# EAGLE schematic 05_ESP32-P4_Display_5.0_inch_V1.0 (EAGLE 9.6.2)
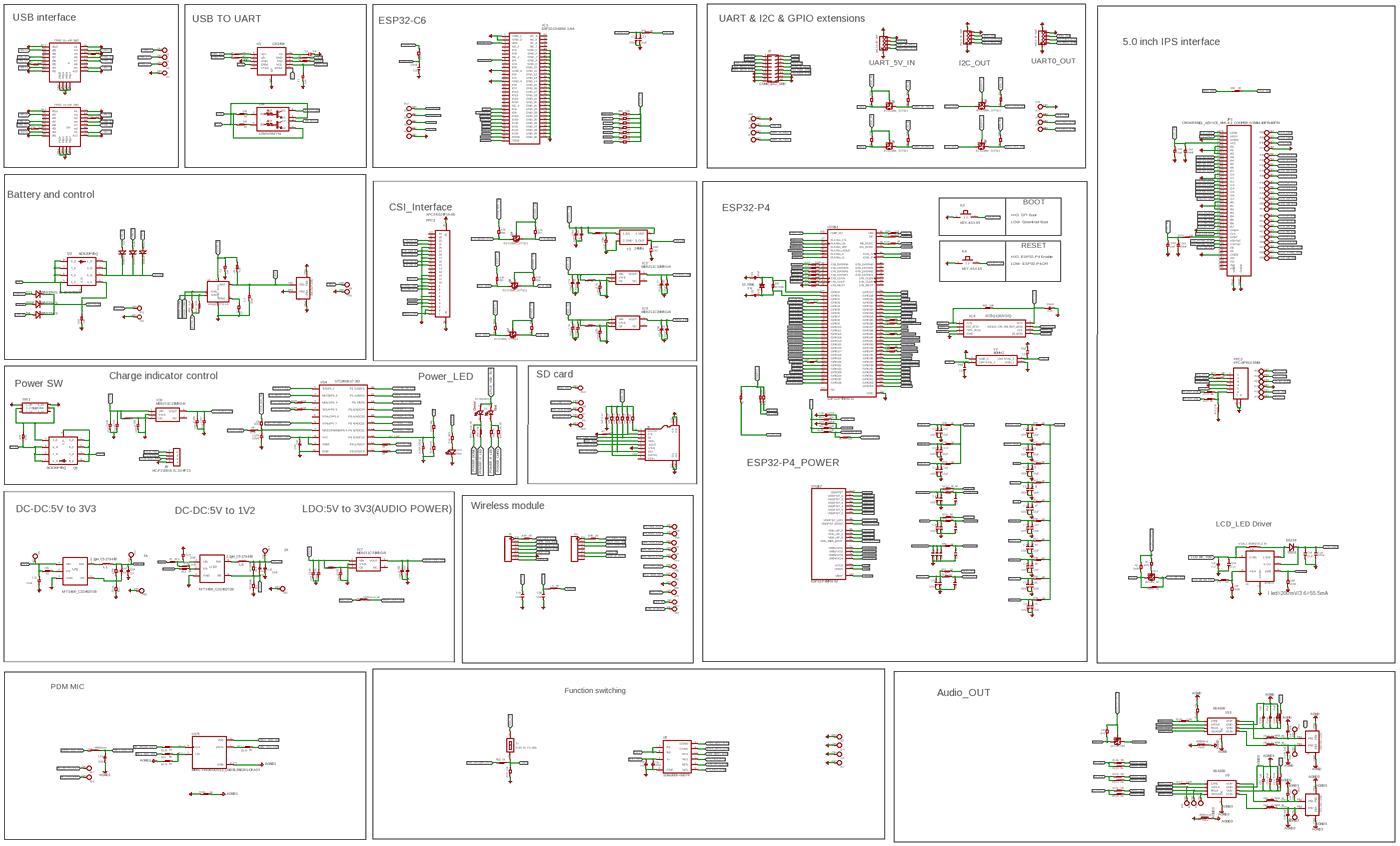
[diagram p0: schematic, sheet 1, overview]
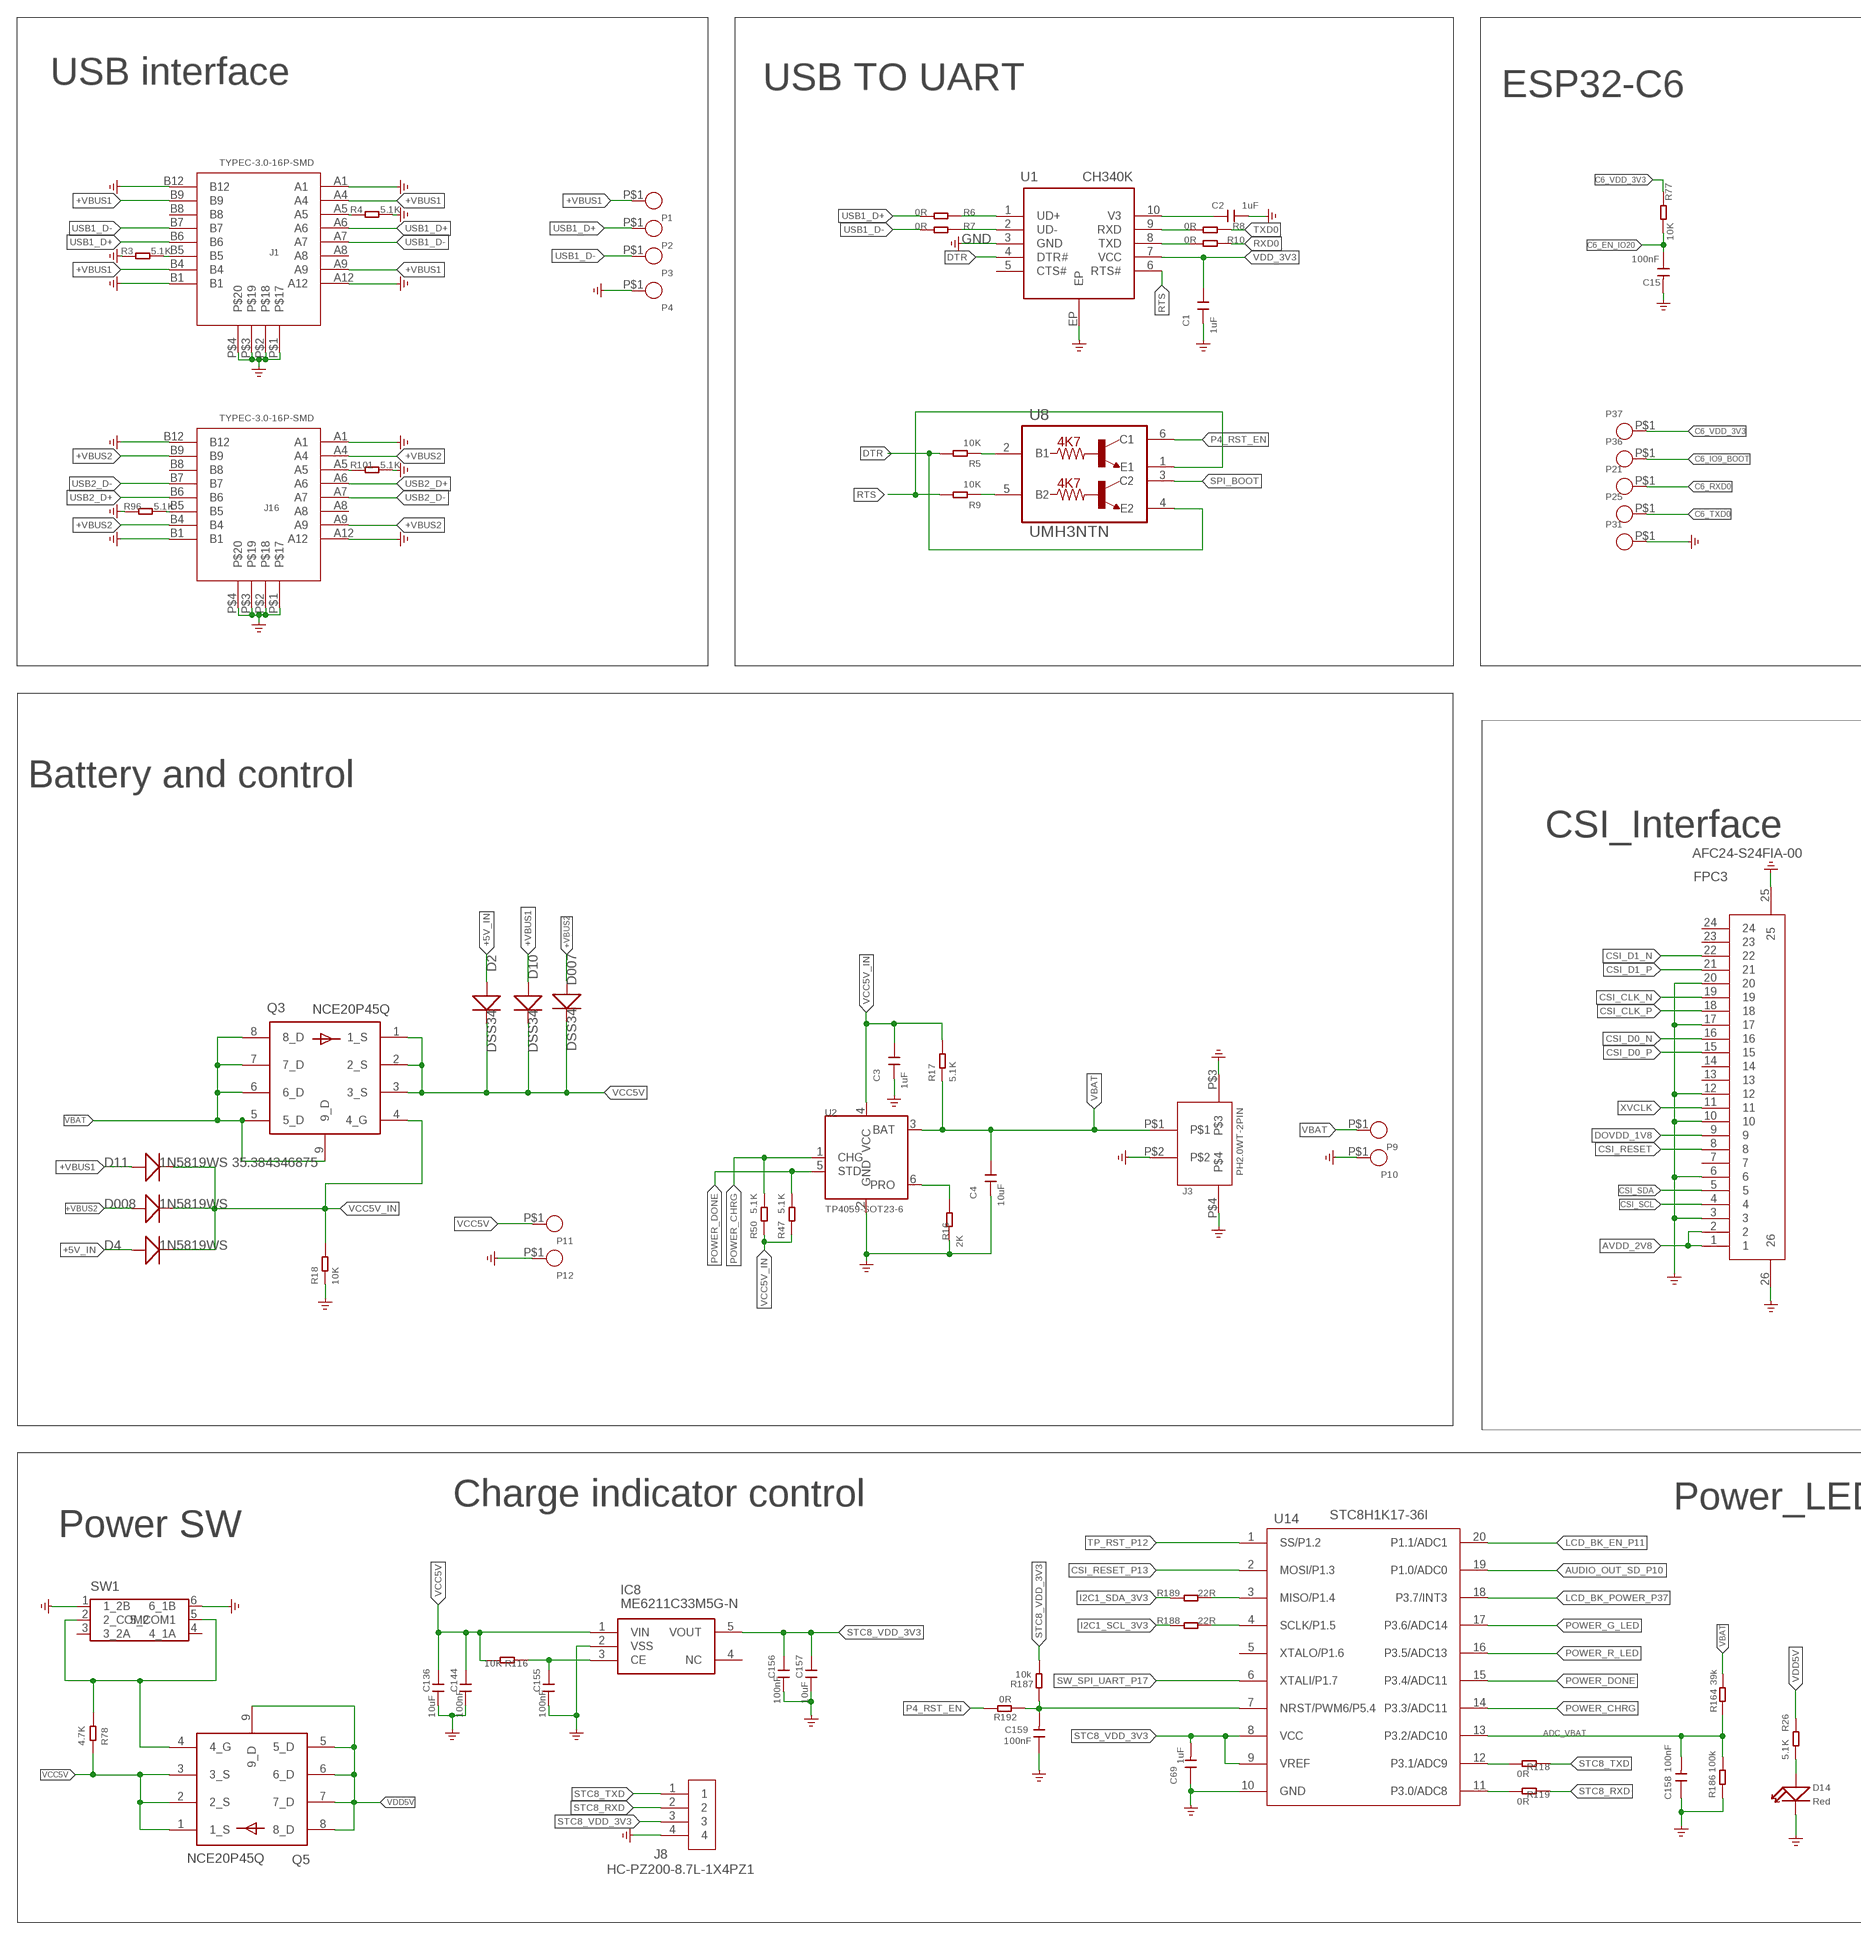
[diagram p1: schematic, sheet 1, part 1 of 8]
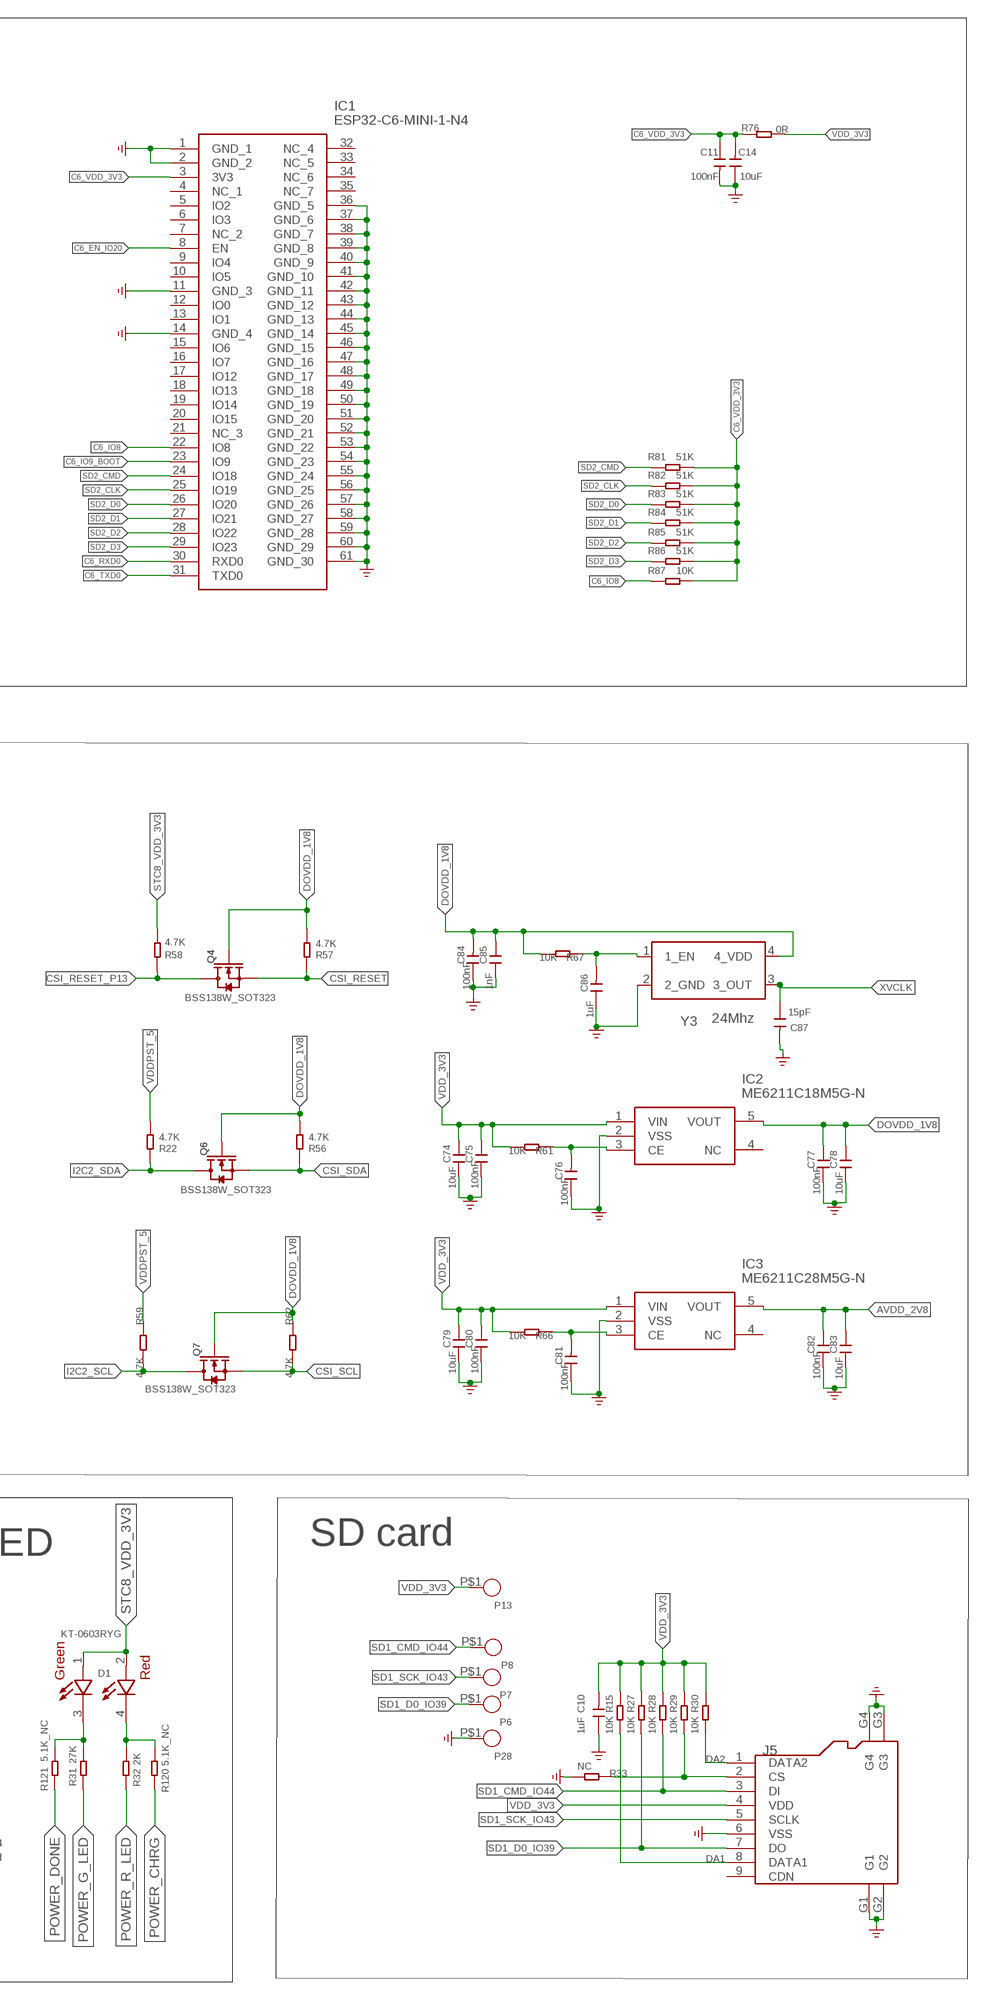
[diagram p2: schematic, sheet 1, part 2 of 8]
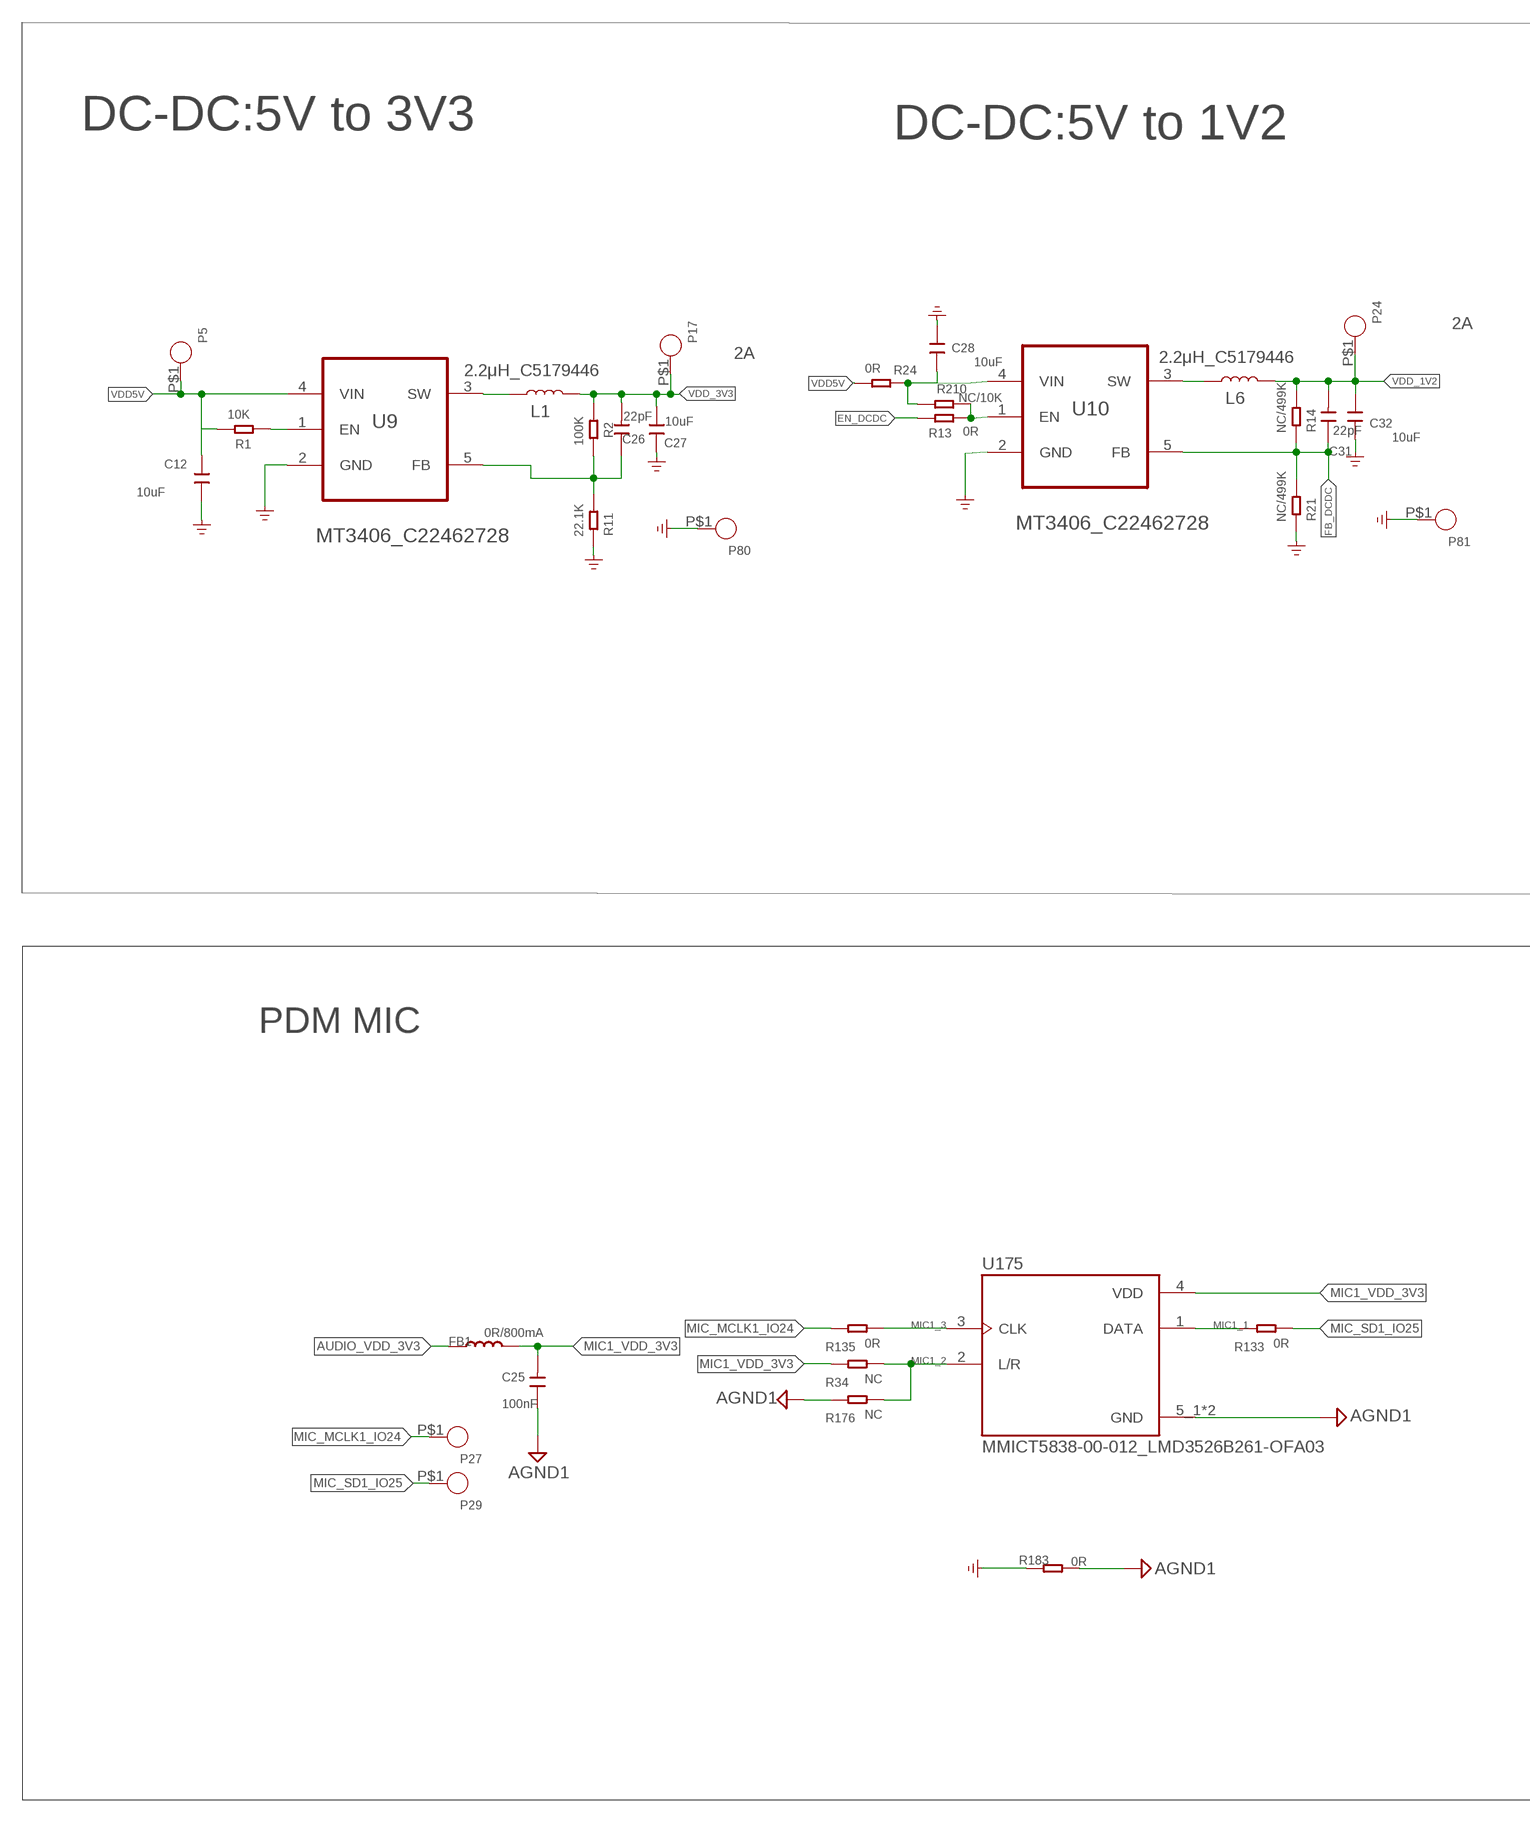
[diagram p3: schematic, sheet 1, part 3 of 8]
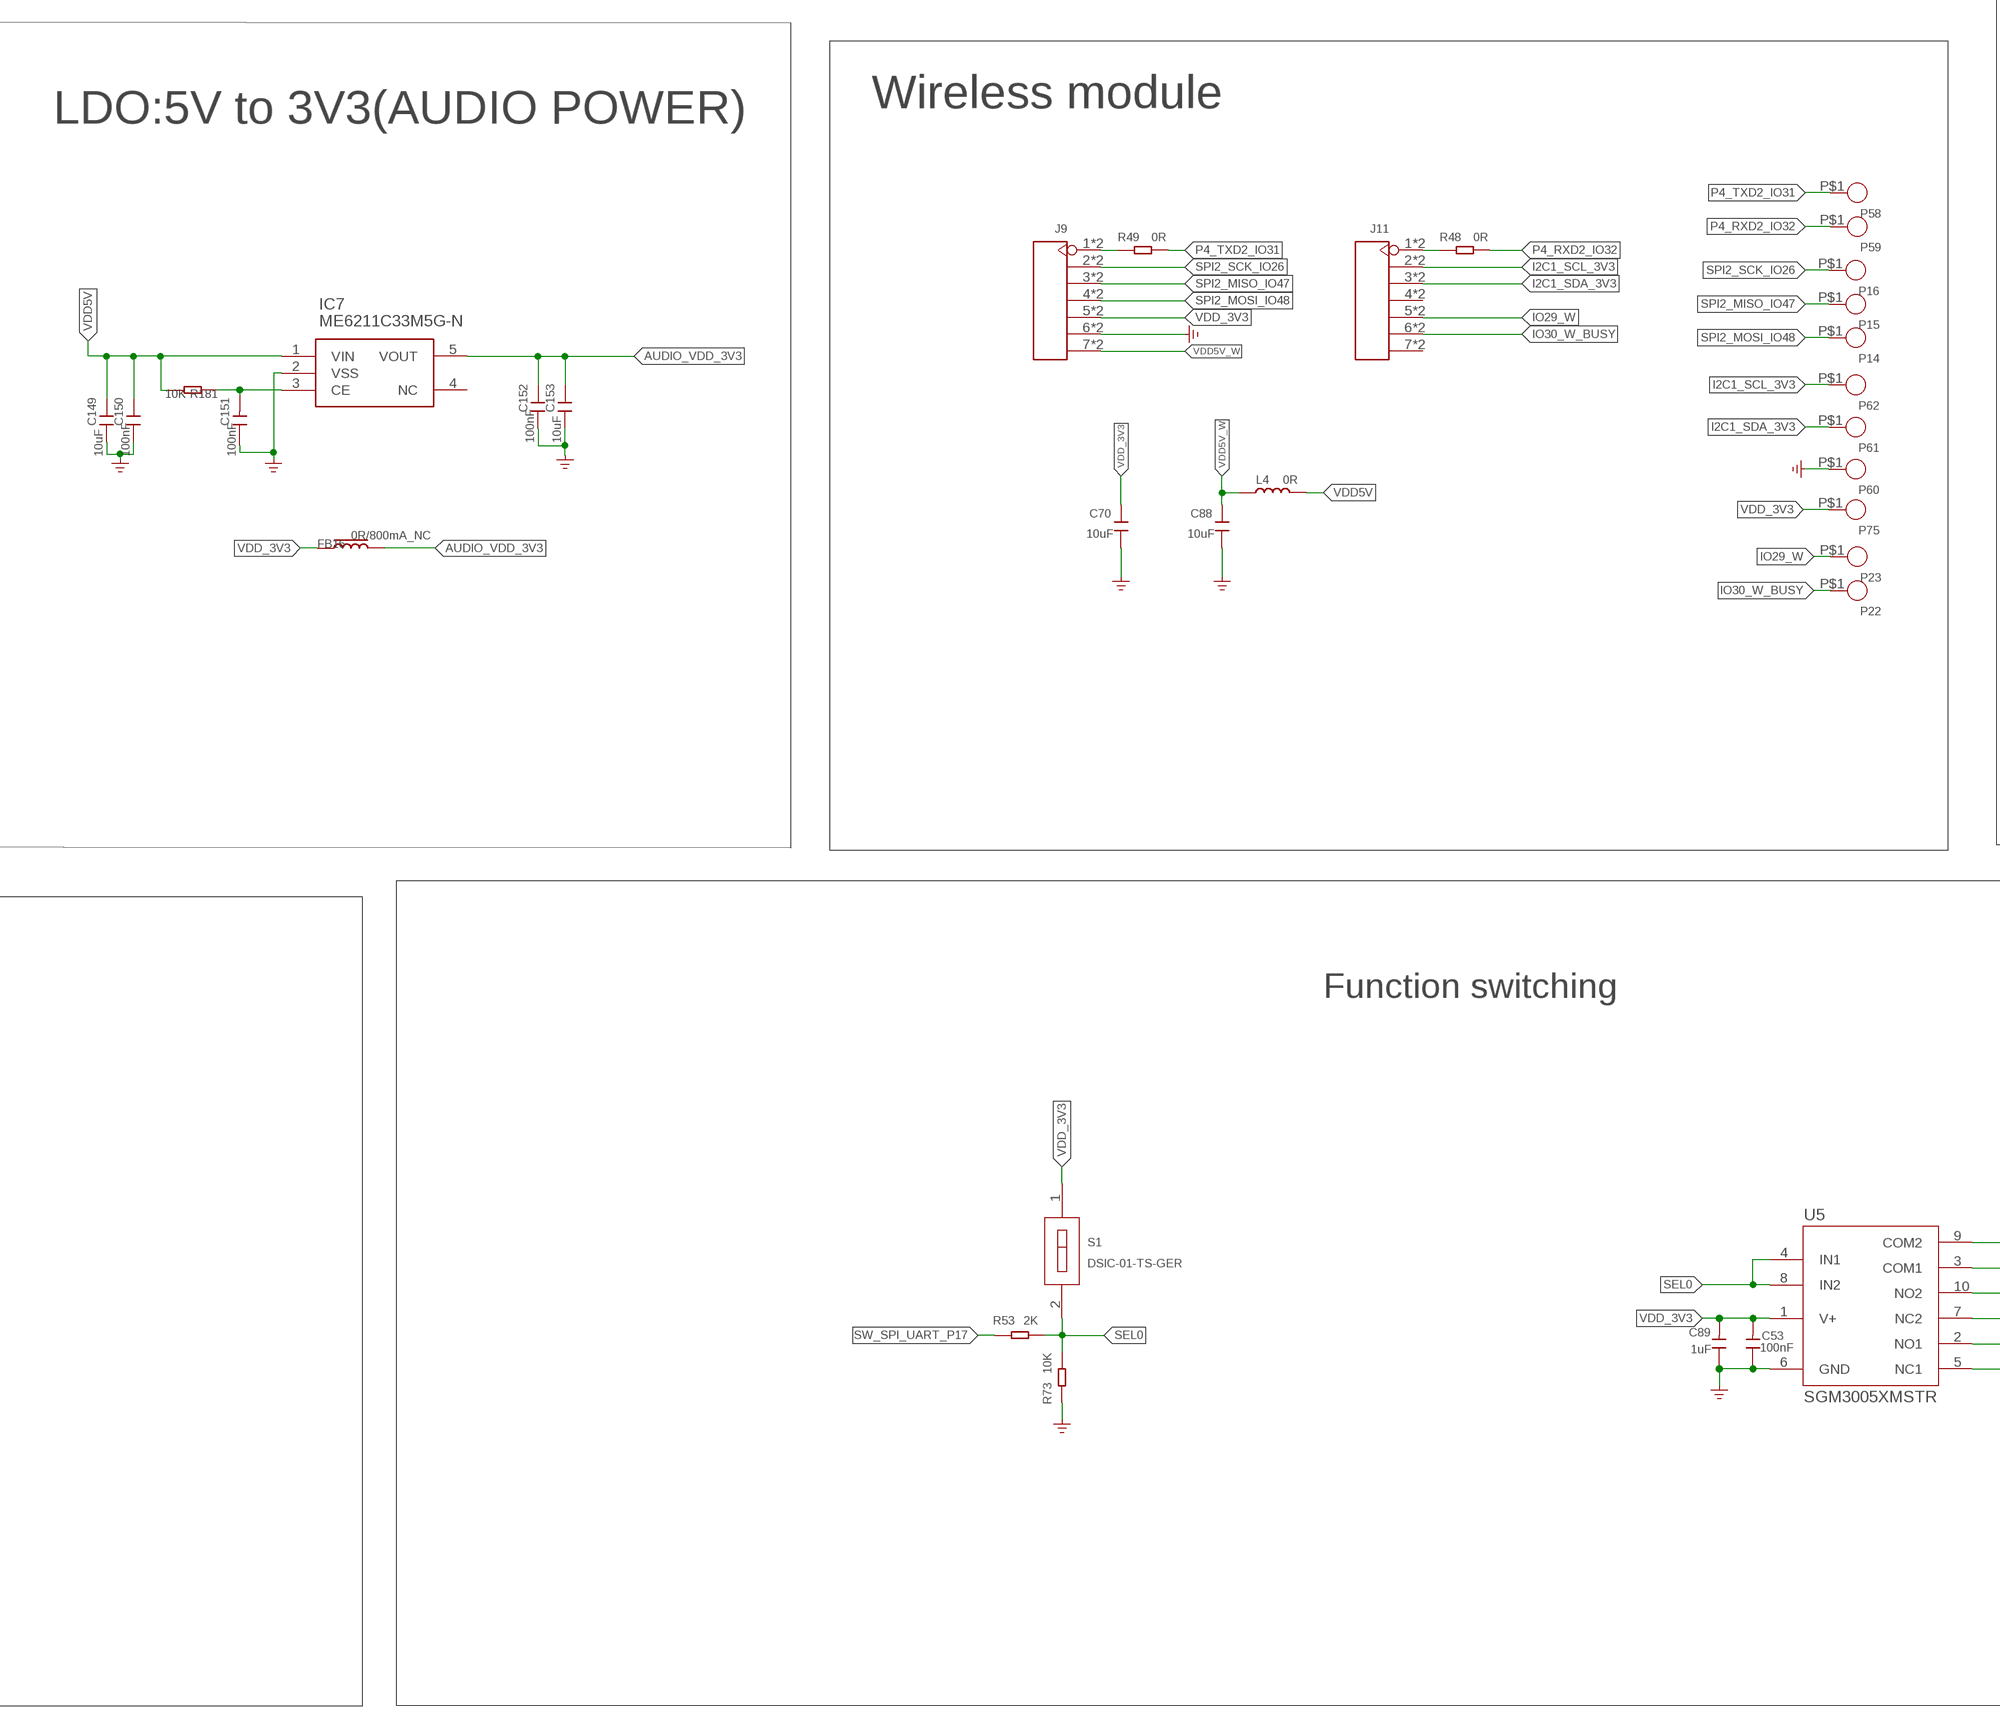
[diagram p4: schematic, sheet 1, part 4 of 8]
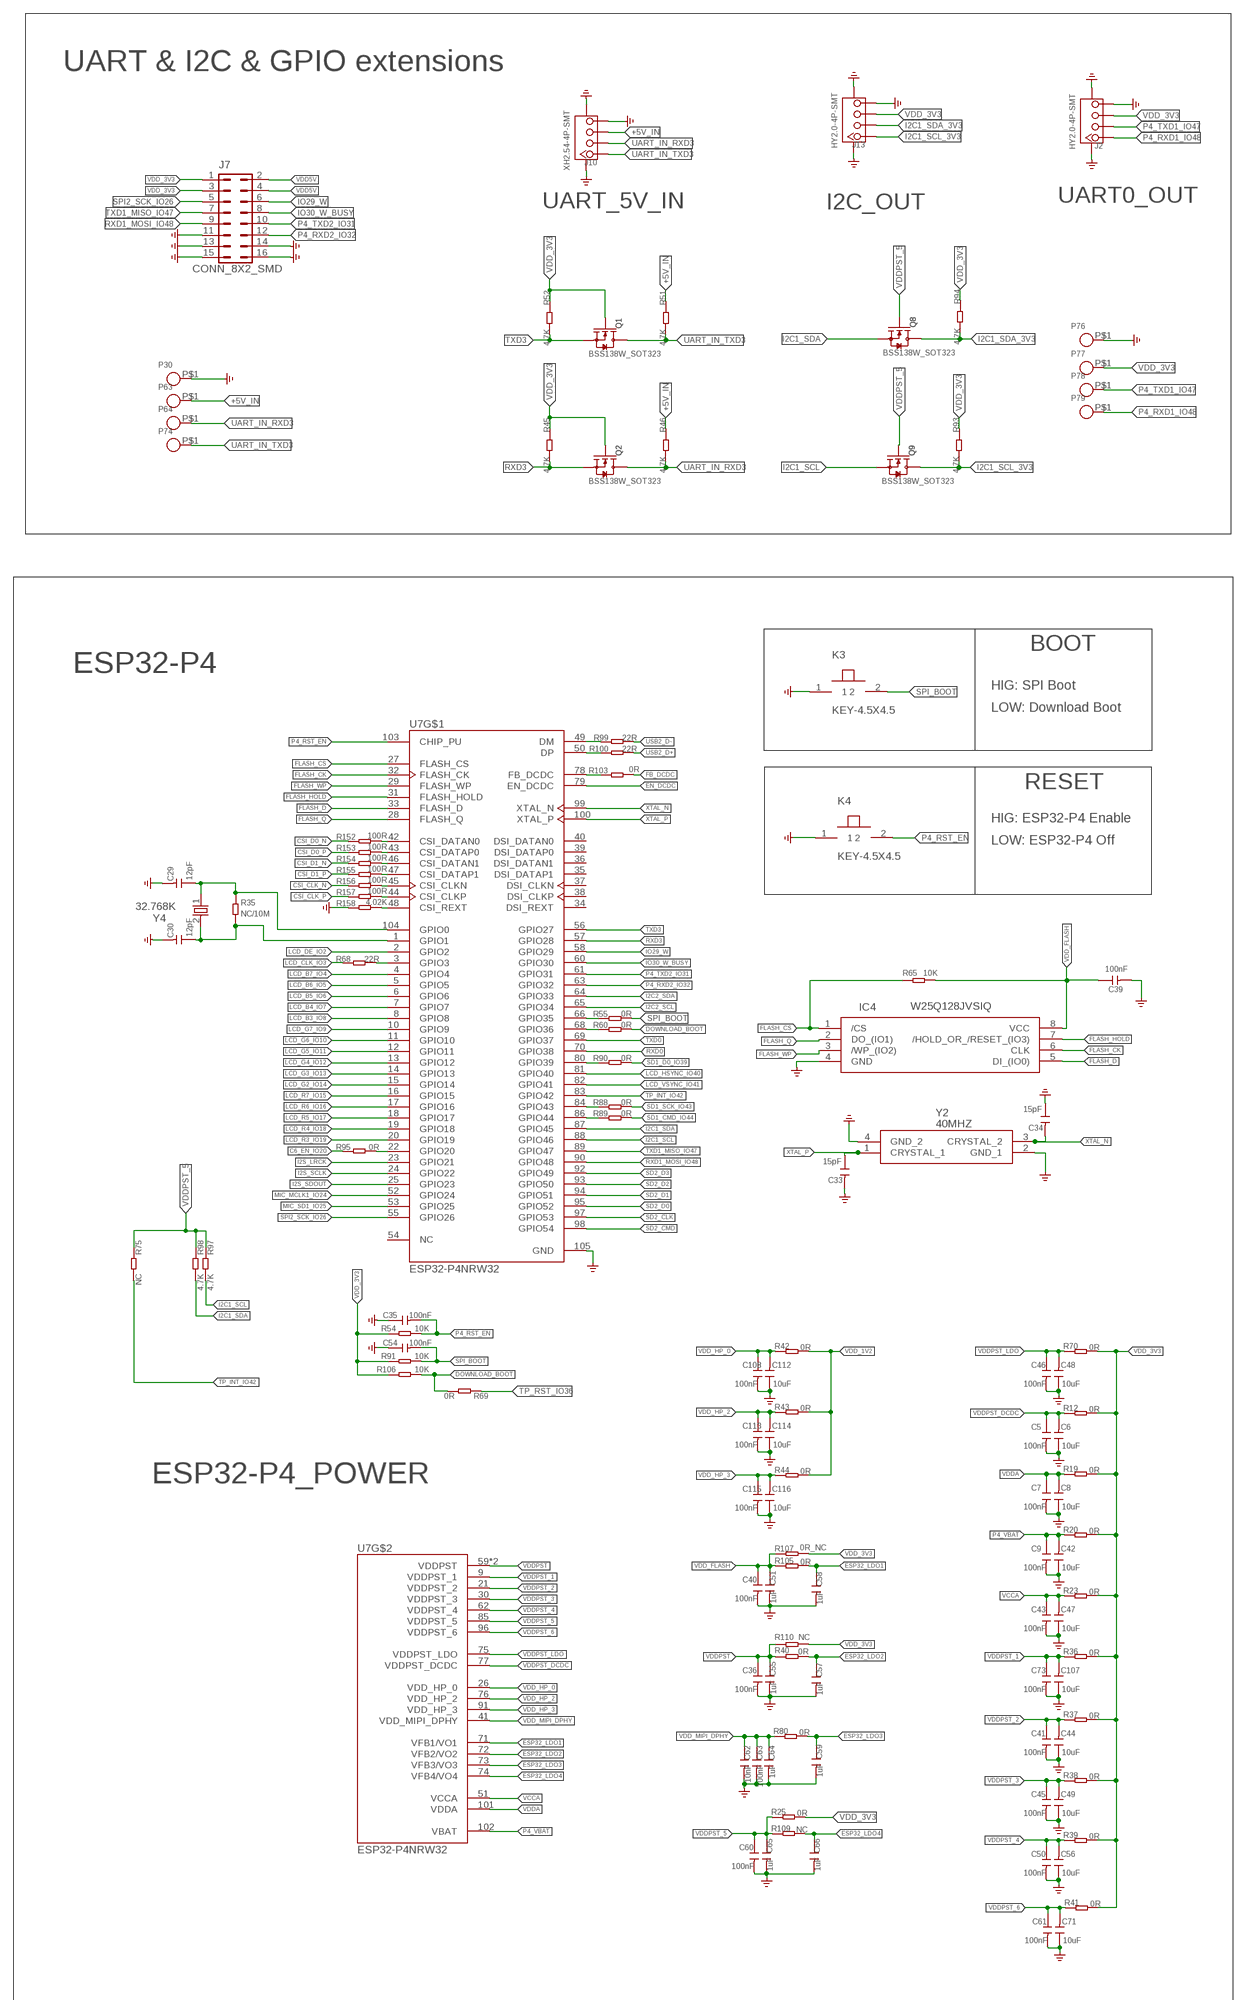
[diagram p5: schematic, sheet 1, part 5 of 8]
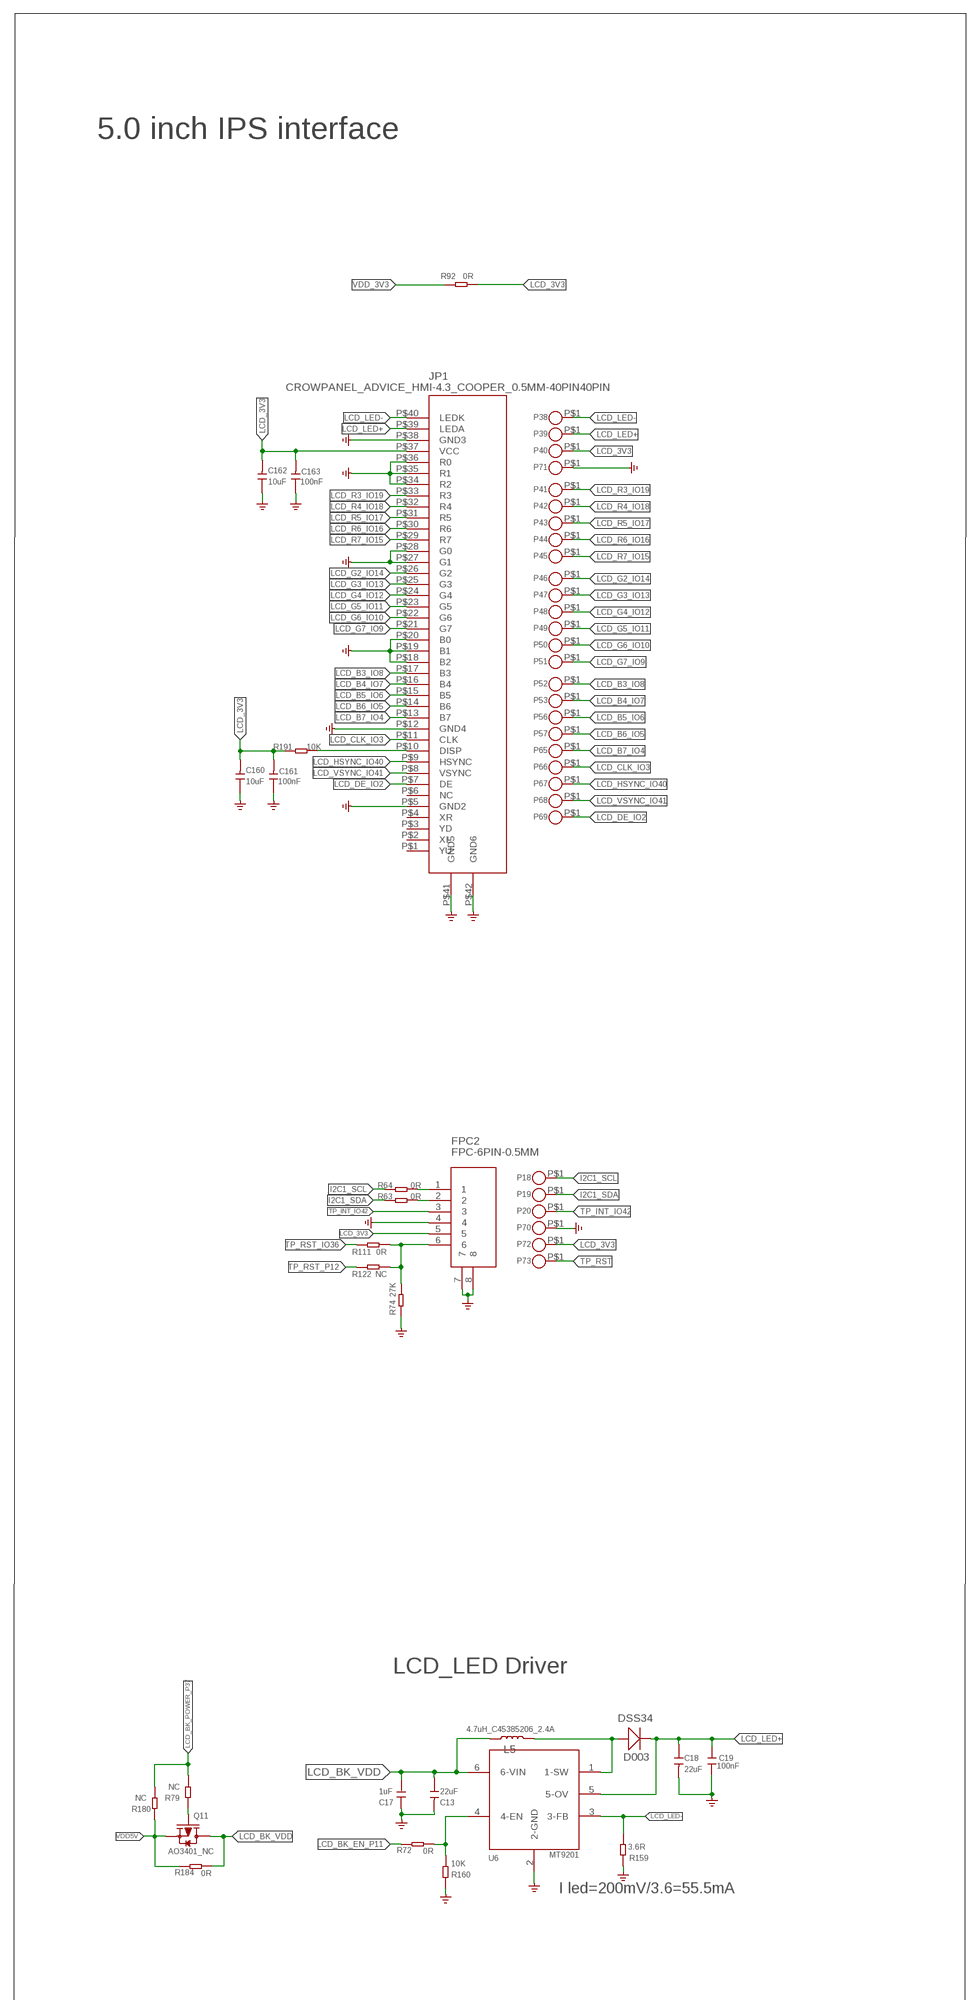
[diagram p6: schematic, sheet 1, part 6 of 8]
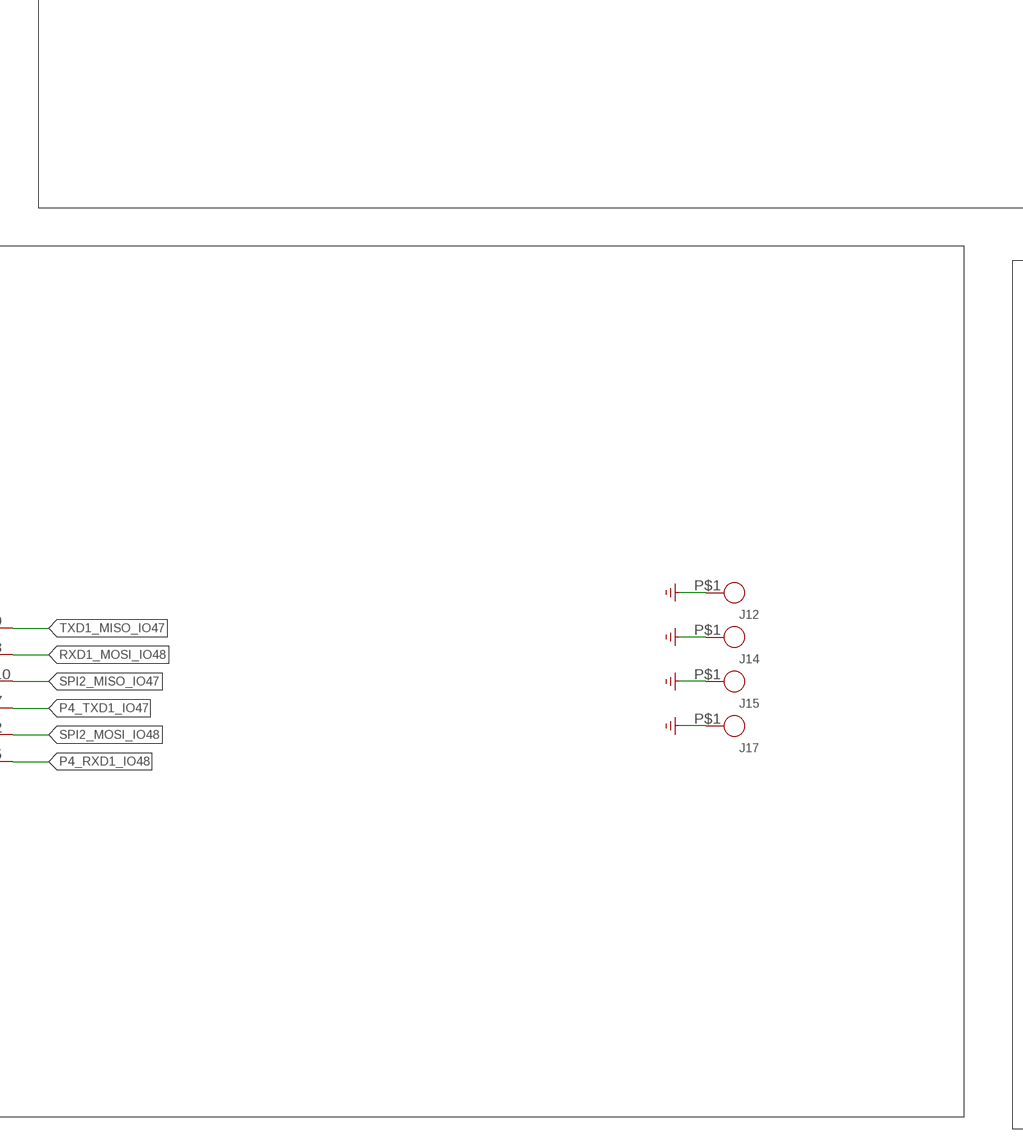
[diagram p7: schematic, sheet 1, part 7 of 8]
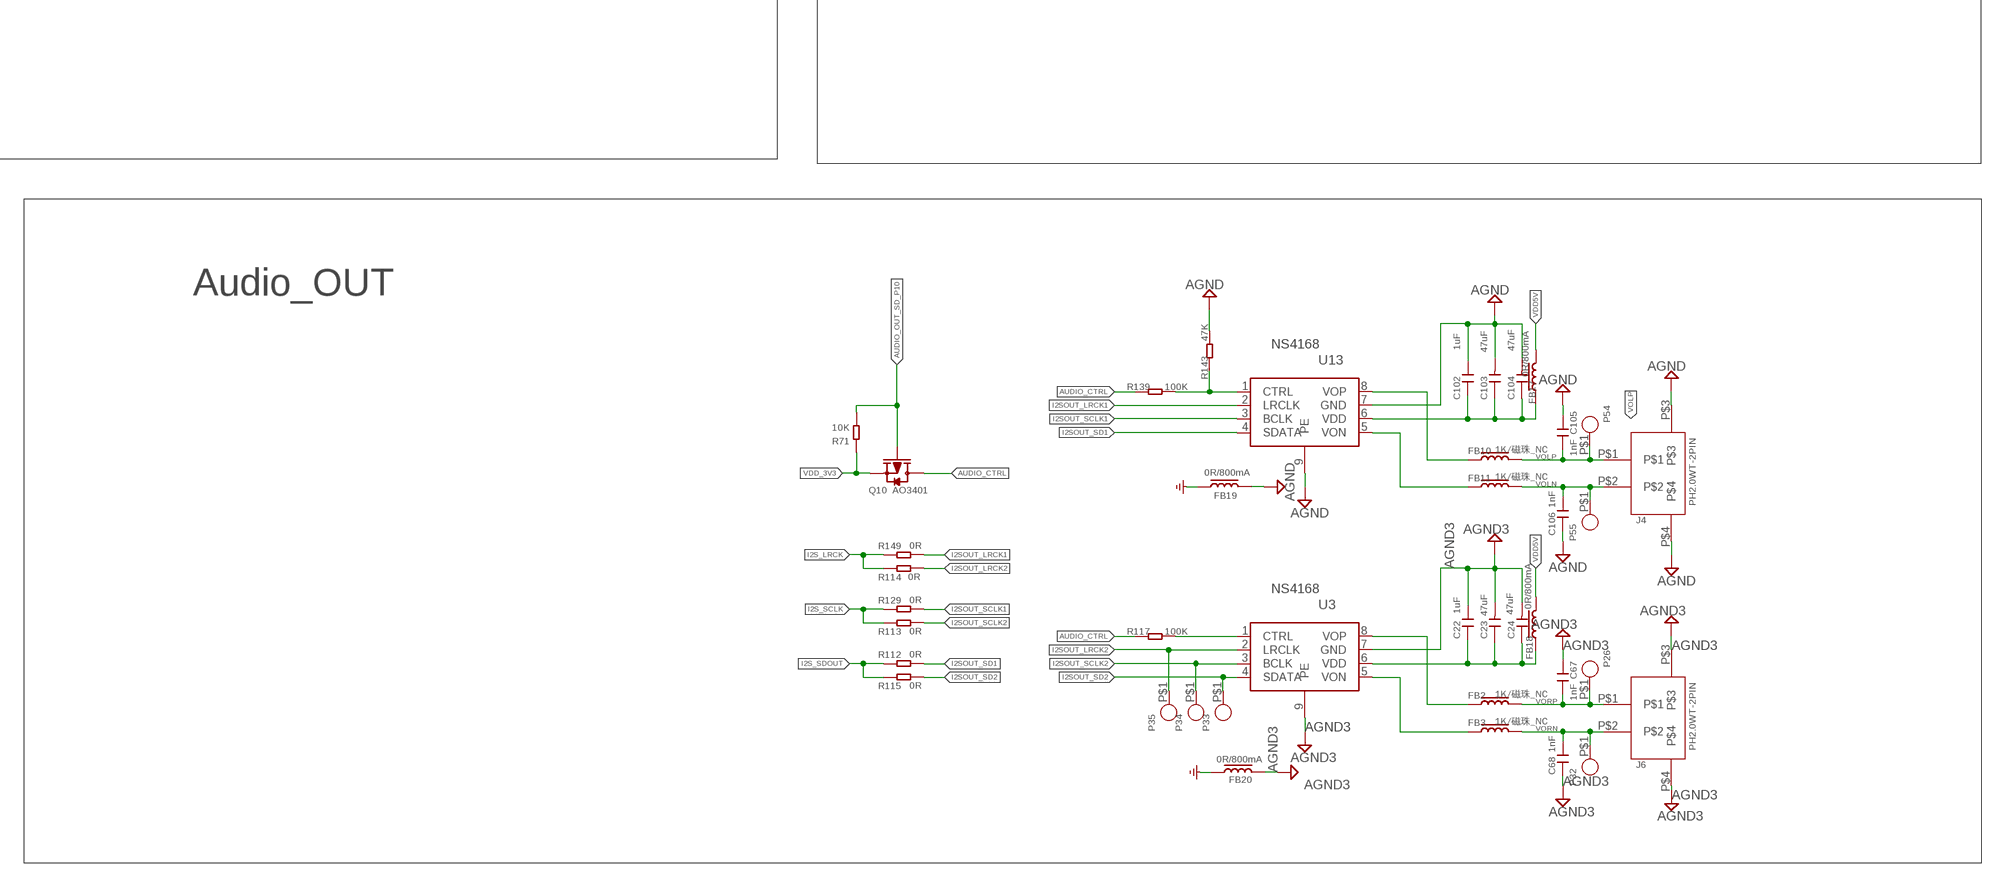
[diagram p8: schematic, sheet 1, part 8 of 8]

## Parts
C1  1uF  C0603  [0603]
C2  1uF  C0603  [0603]
C3  1uF  C0603  [0603]
C4  10uF  C0603  [0603]
C5  100nF  CAPC0402-1  [C0402]
C6  10uF  CAPC0402-1  [C0402]
C7  100nF  CAPC0402-1  [C0402]
C8  10uF  CAPC0402-1  [C0402]
C9  100nF  CAPC0402-1  [C0402]
C10  1uF  CROWPANEL_ADVANCE_HMI_CAPC0402-1  [CROWPANEL_ADVANCE_HMI_C0402]
C11  100nF  CROWPANEL_ADVANCE_HMI_CAPC0402-1  [CROWPANEL_ADVANCE_HMI_C0402]
C12  10uF  C0603  [0603]
C13  22uF  C0805  [C0805]
C14  10uF  CROWPANEL_ADVANCE_HMI_CAPC0402-1  [CROWPANEL_ADVANCE_HMI_C0402]
C15  100nF  CROWPANEL_ADVANCE_HMI_CAPC0402-1  [CROWPANEL_ADVANCE_HMI_C0402]
C17  1uF  C0603  [0603]
C18  22uF  C0805  [C0805]
C19  100nF  C0603  [0603]
C22  1uF  C0603  [0603]
C23  47uF  RC_C0805  [RC_C0805]
C24  47uF  RC_C0805  [RC_C0805]
C25  100nF  CAPC0402-1  [C0402]
C26  22pF  CROWPANEL_ADVANCE_HMI_CAPC0402-1  [CROWPANEL_ADVANCE_HMI_C0402]
C27  10uF  COOPER_C0603  [COOPER_0603]
C28  10uF  C0603  [0603]
C29  12pF  CAPC0402-1  [C0402]
C30  12pF  CAPC0402-1  [C0402]
C31  22pF  CROWPANEL_ADVANCE_HMI_CAPC0402-1  [CROWPANEL_ADVANCE_HMI_C0402]
C32  10uF  COOPER_C0603  [COOPER_0603]
C33  15pF  CAPC0402-1  [C0402]
C34  15pF  CAPC0402-1  [C0402]
C35  100nF  CROWPANEL_ADVANCE_HMI_CAPC0402-1  [CROWPANEL_ADVANCE_HMI_C0402]
C36  100nF  CAPC0402-1  [C0402]
C39  100nF  CAPC0402-1  [C0402]
C40  100nF  CAPC0402-1  [C0402]
C41  100nF  CAPC0402-1  [C0402]
C42  10uF  CAPC0402-1  [C0402]
C43  100nF  CAPC0402-1  [C0402]
C44  10uF  CAPC0402-1  [C0402]
C45  100nF  CAPC0402-1  [C0402]
C46  100nF  CAPC0402-1  [C0402]
C47  10uF  CAPC0402-1  [C0402]
C48  10uF  CAPC0402-1  [C0402]
C49  10uF  CAPC0402-1  [C0402]
C50  100nF  CAPC0402-1  [C0402]
C51  1uF  CAPC0402-1  [C0402]
C53  100nF  CAPC0402-1  [C0402]
C54  100nF  CROWPANEL_ADVANCE_HMI_CAPC0402-1  [CROWPANEL_ADVANCE_HMI_C0402]
C55  1uF  CAPC0402-1  [C0402]
C56  10uF  CAPC0402-1  [C0402]
C57  1uF  CAPC0402-1  [C0402]
C58  1uF  CAPC0402-1  [C0402]
C59  1uF  CAPC0402-1  [C0402]
C60  100nF  CAPC0402-1  [C0402]
C61  100nF  CAPC0402-1  [C0402]
C62  10nF  CAPC0402-1  [C0402]
C63  100nF  CAPC0402-1  [C0402]
C64  1uF  CAPC0402-1  [C0402]
C65  1uF  CAPC0402-1  [C0402]
C66  1uF  CAPC0402-1  [C0402]
C67  1nF  C0603  [0603]
C68  1nF  C0603  [0603]
C69  1uF  CROWPANEL_ADVANCE_HMI_CAPC0402-1  [CROWPANEL_ADVANCE_HMI_C0402]
C70  10uF  C0603  [0603]
C71  10uF  CAPC0402-1  [C0402]
C73  100nF  CAPC0402-1  [C0402]
C74  10uF  C0603  [0603]
C75  100nF  C0603  [0603]
C76  100nF  CROWPANEL_ADVANCE_HMI_CAPC0402-1  [CROWPANEL_ADVANCE_HMI_C0402]
C77  100nF  C0603  [0603]
C78  10uF  C0603  [0603]
C79  10uF  C0603  [0603]
C80  100nF  C0603  [0603]
C81  100nF  CROWPANEL_ADVANCE_HMI_CAPC0402-1  [CROWPANEL_ADVANCE_HMI_C0402]
C82  100nF  C0603  [0603]
C83  10uF  C0603  [0603]
C84  100nF  CROWPANEL_ADVANCE_HMI_CAPC0402-1  [CROWPANEL_ADVANCE_HMI_C0402]
C85  1nF  COOPER_C0603  [COOPER_0603]
C86  1uF  CROWPANEL_ADVANCE_HMI_CAPC0402-1  [CROWPANEL_ADVANCE_HMI_C0402]
C87  15pF  CAPC0402-1  [C0402]
C88  10uF  C0603  [0603]
C89  1uF  CAPC0402-1  [C0402]
C102  1uF  C0603  [0603]
C103  47uF  RC_C0805  [RC_C0805]
C104  47uF  RC_C0805  [RC_C0805]
C105  1nF  C0603  [0603]
C106  1nF  C0603  [0603]
C107  10uF  CAPC0402-1  [C0402]
C108  100nF  CAPC0402-1  [C0402]
C112  10uF  CAPC0402-1  [C0402]
C113  100nF  CAPC0402-1  [C0402]
C114  10uF  CAPC0402-1  [C0402]
C115  100nF  CAPC0402-1  [C0402]
C116  10uF  CAPC0402-1  [C0402]
C136  10uF  C0603  [0603]
C144  100nF  C0603  [0603]
C149  10uF  COOPER_C0603  [COOPER_0603]
C150  100nF  COOPER_C0603  [COOPER_0603]
C151  100nF  CROWPANEL_ADVANCE_HMI_CAPC0402-1  [CROWPANEL_ADVANCE_HMI_C0402]
C152  100nF  COOPER_C0603  [COOPER_0603]
C153  10uF  COOPER_C0603  [COOPER_0603]
C155  100nF  C0603  [0603]
C156  100nF  C0603  [0603]
C157  10uF  C0603  [0603]
C158  100nF  CROWPANEL_ADVANCE_HMI_CAPC0402-1  [CROWPANEL_ADVANCE_HMI_C0402]
C159  100nF  CROWPANEL_ADVANCE_HMI_CAPC0402-1  [CROWPANEL_ADVANCE_HMI_C0402]
C160  10uF  CROWPANEL_ADVANCE_HMI_CAPC0402-1  [CROWPANEL_ADVANCE_HMI_C0402]
C161  100nF  CROWPANEL_ADVANCE_HMI_CAPC0402-1  [CROWPANEL_ADVANCE_HMI_C0402]
C162  10uF  CROWPANEL_ADVANCE_HMI_CAPC0402-1  [CROWPANEL_ADVANCE_HMI_C0402]
C163  100nF  CROWPANEL_ADVANCE_HMI_CAPC0402-1  [CROWPANEL_ADVANCE_HMI_C0402]
D1  KT-0603RYG  [LED_KT-0603RYG]
D2  DSS34  DIODE  [D_SOD123FL]
D003  DSS34  DIODE  [D_SOD123FL]
D4  1N5819WS  DIODE0805  [D_SOD323]
D007  DSS34  DIODE  [D_SOD123FL]
D008  1N5819WS  DIODE0805  [D_SOD323]
D10  DSS34  DIODE  [D_SOD123FL]
D11  1N5819WS 35.384346875  DIODE0805  [D_SOD323]
D14  Red  LED-SMT0603  [LED0603]
FB1  0R/800mA  L0402  [L0402]
FB2  1K/磁珠_NC  FBL0603  [L0603]
FB3  1K/磁珠_NC  FBL0603  [L0603]
FB10  1K/磁珠_NC  FBL0603  [L0603]
FB11  1K/磁珠_NC  FBL0603  [L0603]
FB16  0R/800mA_NC  FBL0603  [L0603]
FB17  0R/800mA  FBL0603  [L0603]
FB18  0R/800mA  FBL0603  [L0603]
FB19  0R/800mA  FBL0603  [L0603]
FB20  0R/800mA  FBL0603  [L0603]
FPC2  FPC-6PIN-0.5MM  [FPC-6PIN-0.5MM]
FPC3  AFC24-S24FIA-00  [FPC-SMD_P0.50-24P_QCHF-SM-H2.0]
IC1  ESP32-C6-MINI-1-N4  [ESP32C6MINI1N4]
IC2  ME6211C18M5G-N  [SOT95P282X145-5N]
IC3  ME6211C28M5G-N  ME6211C18M5G-N  [SOT95P282X145-5N]
IC4  W25Q128JVSIQ  [SOIC127P790X216-8N]
IC7  ME6211C33M5G-N  ME6211C18M5G-N  [SOT95P282X145-5N]
IC8  ME6211C33M5G-N  ME6211C18M5G-N  [SOT95P282X145-5N]
J1  TYPEC-3.0-16P-SMD  [USB-3.0TYPEC-SMD]
J2  HY2.0-4P-SMT  CONNECTOR_TWIG-4P-2.0-SMD-FEMALE-REINFORCEDD  [CONNECTOR_4P-SMD-2.0]
J3  PH2.0WT-2PIN  [PH2.0WT-2PIN]
J4  PH2.0WT-2PIN  [PH2.0WT-2PIN]
J5  HOLDER-MICROSD-9P  [9P-SMD-W/-RING]
J6  PH2.0WT-2PIN  [PH2.0WT-2PIN]
J7  CONN_8X2_SMD  [2X8_SMD]
J8  HC-PZ200-8.7L-1X4PZ1  [TEST-PIN-4-2.0MM]
J9  HEADER-7P-18.28X2.5  [H7-2.54-18.28X2.5X5MM]
J10  XH2.54-4P-SMT  [XH2.54-4P-SMD]
J11  HEADER-7P-18.28X2.5  [H7-2.54-18.28X2.5X5MM]
J12  CROWPANEL_ADVANCE_HMI_THO-M3.25MM-HOLE  [CROWPANEL_ADVANCE_HMI_THO-M3.2*5MM-HOLE]
J13  HY2.0-4P-SMT  CONNECTOR_TWIG-4P-2.0-SMD-FEMALE-REINFORCEDD  [CONNECTOR_4P-SMD-2.0]
J14  CROWPANEL_ADVANCE_HMI_THO-M3.25MM-HOLE  [CROWPANEL_ADVANCE_HMI_THO-M3.2*5MM-HOLE]
J15  CROWPANEL_ADVANCE_HMI_THO-M3.25MM-HOLE  [CROWPANEL_ADVANCE_HMI_THO-M3.2*5MM-HOLE]
J16  TYPEC-3.0-16P-SMD  [USB-3.0TYPEC-SMD]
J17  CROWPANEL_ADVANCE_HMI_THO-M3.25MM-HOLE  [CROWPANEL_ADVANCE_HMI_THO-M3.2*5MM-HOLE]
JP1  CROWPANEL_ADVICE_HMI-4.3_COOPER_0.5MM-40PIN40PIN  [CROWPANEL_ADVICE_HMI-4.3_COOPER_0.5MM*40P]
K3  KEY-4.5X4.5  KEY-6KEY-4.5X4.5  [KEY-4.5X4.5-SMD]
K4  KEY-4.5X4.5  KEY-6KEY-4.5X4.5  [KEY-4.5X4.5-SMD]
L1  2.2μH_C5179446  4.7μH_SHIELDED_INDUCTOR  [1008(2520)]
L4  0R  L0603  [L0603]
L5  4.7uH_C45385206_2.4A  4.7μH_SHIELDED_INDUCTOR  [1008(2520)]
L6  2.2μH_C5179446  4.7μH_SHIELDED_INDUCTOR  [1008(2520)]
P1  TEST_PADPAD-1.5MM  [TEST_PAD-1.5MM]
P2  TEST_PADPAD-1.5MM  [TEST_PAD-1.5MM]
P3  TEST_PADPAD-1.5MM  [TEST_PAD-1.5MM]
P4  TEST_PADPAD-1.5MM  [TEST_PAD-1.5MM]
P5  TEST_PADPAD-1.5MM  [TEST_PAD-1.5MM]
P6  TEST_PADPAD-1.5MM  [TEST_PAD-1.5MM]
P7  TEST_PADPAD-1.5MM  [TEST_PAD-1.5MM]
P8  TEST_PADPAD-1.5MM  [TEST_PAD-1.5MM]
P9  TEST_PADPAD-1.5MM  [TEST_PAD-1.5MM]
P10  TEST_PADPAD-1.5MM  [TEST_PAD-1.5MM]
P11  TEST_PADPAD-1.5MM  [TEST_PAD-1.5MM]
P12  TEST_PADPAD-1.5MM  [TEST_PAD-1.5MM]
P13  TEST_PADPAD-1.5MM  [TEST_PAD-1.5MM]
P14  TEST_PADPAD-1.5MM  [TEST_PAD-1.5MM]
P15  TEST_PADPAD-1.5MM  [TEST_PAD-1.5MM]
P16  TEST_PADPAD-1.5MM  [TEST_PAD-1.5MM]
P17  TEST_PADPAD-1.5MM  [TEST_PAD-1.5MM]
P18  TEST_PADPAD-1.5MM  [TEST_PAD-1.5MM]
P19  TEST_PADPAD-1.5MM  [TEST_PAD-1.5MM]
P20  TEST_PADPAD-1.5MM  [TEST_PAD-1.5MM]
P21  TEST_PADPAD-1.5MM  [TEST_PAD-1.5MM]
P22  TEST_PADPAD-1.5MM  [TEST_PAD-1.5MM]
P23  TEST_PADPAD-1.5MM  [TEST_PAD-1.5MM]
P24  TEST_PADPAD-1.5MM  [TEST_PAD-1.5MM]
P25  TEST_PADPAD-1.5MM  [TEST_PAD-1.5MM]
P26  TEST_PADPAD-1.5MM  [TEST_PAD-1.5MM]
P27  TEST_PADPAD-1.5MM  [TEST_PAD-1.5MM]
P28  TEST_PADPAD-1.5MM  [TEST_PAD-1.5MM]
P29  TEST_PADPAD-1.5MM  [TEST_PAD-1.5MM]
P30  TEST_PADPAD-1.5MM  [TEST_PAD-1.5MM]
P31  TEST_PADPAD-1.5MM  [TEST_PAD-1.5MM]
P32  TEST_PADPAD-1.5MM  [TEST_PAD-1.5MM]
P33  TEST_PADPAD-1.5MM  [TEST_PAD-1.5MM]
P34  TEST_PADPAD-1.5MM  [TEST_PAD-1.5MM]
P35  TEST_PADPAD-1.5MM  [TEST_PAD-1.5MM]
P36  TEST_PADPAD-1.5MM  [TEST_PAD-1.5MM]
P37  TEST_PADPAD-1.5MM  [TEST_PAD-1.5MM]
P38  TEST_PADPAD-1.5MM  [TEST_PAD-1.5MM]
P39  TEST_PADPAD-1.5MM  [TEST_PAD-1.5MM]
P40  TEST_PADPAD-1.5MM  [TEST_PAD-1.5MM]
P41  TEST_PADPAD-1.5MM  [TEST_PAD-1.5MM]
P42  TEST_PADPAD-1.5MM  [TEST_PAD-1.5MM]
P43  TEST_PADPAD-1.5MM  [TEST_PAD-1.5MM]
P44  TEST_PADPAD-1.5MM  [TEST_PAD-1.5MM]
P45  TEST_PADPAD-1.5MM  [TEST_PAD-1.5MM]
P46  TEST_PADPAD-1.5MM  [TEST_PAD-1.5MM]
P47  TEST_PADPAD-1.5MM  [TEST_PAD-1.5MM]
P48  TEST_PADPAD-1.5MM  [TEST_PAD-1.5MM]
P49  TEST_PADPAD-1.5MM  [TEST_PAD-1.5MM]
P50  TEST_PADPAD-1.5MM  [TEST_PAD-1.5MM]
P51  TEST_PADPAD-1.5MM  [TEST_PAD-1.5MM]
P52  TEST_PADPAD-1.5MM  [TEST_PAD-1.5MM]
P53  TEST_PADPAD-1.5MM  [TEST_PAD-1.5MM]
P54  TEST_PADPAD-1.5MM  [TEST_PAD-1.5MM]
P55  TEST_PADPAD-1.5MM  [TEST_PAD-1.5MM]
P56  TEST_PADPAD-1.5MM  [TEST_PAD-1.5MM]
P57  TEST_PADPAD-1.5MM  [TEST_PAD-1.5MM]
P58  TEST_PADPAD-1.5MM  [TEST_PAD-1.5MM]
P59  TEST_PADPAD-1.5MM  [TEST_PAD-1.5MM]
P60  TEST_PADPAD-1.5MM  [TEST_PAD-1.5MM]
P61  TEST_PADPAD-1.5MM  [TEST_PAD-1.5MM]
P62  TEST_PADPAD-1.5MM  [TEST_PAD-1.5MM]
P63  TEST_PADPAD-1.5MM  [TEST_PAD-1.5MM]
P64  TEST_PADPAD-1.5MM  [TEST_PAD-1.5MM]
P65  TEST_PADPAD-1.5MM  [TEST_PAD-1.5MM]
P66  TEST_PADPAD-1.5MM  [TEST_PAD-1.5MM]
P67  TEST_PADPAD-1.5MM  [TEST_PAD-1.5MM]
P68  TEST_PADPAD-1.5MM  [TEST_PAD-1.5MM]
P69  TEST_PADPAD-1.5MM  [TEST_PAD-1.5MM]
P70  TEST_PADPAD-1.5MM  [TEST_PAD-1.5MM]
P71  TEST_PADPAD-1.5MM  [TEST_PAD-1.5MM]
P72  TEST_PADPAD-1.5MM  [TEST_PAD-1.5MM]
P73  TEST_PADPAD-1.5MM  [TEST_PAD-1.5MM]
P74  TEST_PADPAD-1.5MM  [TEST_PAD-1.5MM]
P75  TEST_PADPAD-1.5MM  [TEST_PAD-1.5MM]
P76  TEST_PADPAD-1.5MM  [TEST_PAD-1.5MM]
P77  TEST_PADPAD-1.5MM  [TEST_PAD-1.5MM]
P78  TEST_PADPAD-1.5MM  [TEST_PAD-1.5MM]
P79  TEST_PADPAD-1.5MM  [TEST_PAD-1.5MM]
P80  TEST_PADPAD-1.5MM  [TEST_PAD-1.5MM]
P81  TEST_PADPAD-1.5MM  [TEST_PAD-1.5MM]
Q1  BSS138W_SOT323  MOSFET-NSI1304BDL  [MOS_SOT323]
Q2  BSS138W_SOT323  MOSFET-NSI1304BDL  [MOS_SOT323]
Q3  NCE20P45Q  MY_LIB_RU30L30M  [MY_LIB_PDFN3333]
Q4  BSS138W_SOT323  MOSFET-NSI1304BDL  [MOS_SOT323]
Q5  NCE20P45Q  MY_LIB_RU30L30M  [MY_LIB_PDFN3333]
Q6  BSS138W_SOT323  MOSFET-NSI1304BDL  [MOS_SOT323]
Q7  BSS138W_SOT323  MOSFET-NSI1304BDL  [MOS_SOT323]
Q8  BSS138W_SOT323  MOSFET-NSI1304BDL  [MOS_SOT323]
Q9  BSS138W_SOT323  MOSFET-NSI1304BDL  [MOS_SOT323]
Q10  AO3401  MOSFET-PSOT23  [PMOS_SOT23]
Q11  AO3401_NC  MOSFET-PSOT23  [PMOS_SOT23]
R1  10K  CROWPANEL_ADVANCE_HMI_RES-0402  [CROWPANEL_ADVANCE_HMI_R0402]
R2  100K  CROWPANEL_ADVANCE_HMI_RES-0402  [CROWPANEL_ADVANCE_HMI_R0402]
R3  5.1K  CROWPANEL_ADVANCE_HMI_RES-0402  [CROWPANEL_ADVANCE_HMI_R0402]
R4  5.1K  CROWPANEL_ADVANCE_HMI_RES-0402  [CROWPANEL_ADVANCE_HMI_R0402]
R5  10K  CROWPANEL_ADVANCE_HMI_RES-0402  [CROWPANEL_ADVANCE_HMI_R0402]
R6  0R  CROWPANEL_ADVANCE_HMI_RES-0402  [CROWPANEL_ADVANCE_HMI_R0402]
R7  0R  CROWPANEL_ADVANCE_HMI_RES-0402  [CROWPANEL_ADVANCE_HMI_R0402]
R8  0R  CROWPANEL_ADVANCE_HMI_RES-0402  [CROWPANEL_ADVANCE_HMI_R0402]
R9  10K  CROWPANEL_ADVANCE_HMI_RES-0402  [CROWPANEL_ADVANCE_HMI_R0402]
R10  0R  CROWPANEL_ADVANCE_HMI_RES-0402  [CROWPANEL_ADVANCE_HMI_R0402]
R11  22.1K  CROWPANEL_ADVANCE_HMI_RES-0402  [CROWPANEL_ADVANCE_HMI_R0402]
R12  0R  RES-0402  [R0402]
R13  0R  CROWPANEL_ADVANCE_HMI_RES-0402  [CROWPANEL_ADVANCE_HMI_R0402]
R14  NC/499K  CROWPANEL_ADVANCE_HMI_RES-0402  [CROWPANEL_ADVANCE_HMI_R0402]
R15  10K  CROWPANEL_ADVANCE_HMI_RES-0402  [CROWPANEL_ADVANCE_HMI_R0402]
R16  2K  RES-0603  [R0603-SP]
R17  5.1K  R0603  [R0603]
R18  10K  CROWPANEL_ADVANCE_HMI_RES-0402  [CROWPANEL_ADVANCE_HMI_R0402]
R19  0R  RES-0402  [R0402]
R20  0R  RES-0402  [R0402]
R21  NC/499K  CROWPANEL_ADVANCE_HMI_RES-0402  [CROWPANEL_ADVANCE_HMI_R0402]
R22  4.7K  R0603  [R0603]
R23  0R  RES-0402  [R0402]
R24  0R  R0603  [R0603]
R25  0R  RES-0402  [R0402]
R26  5.1K  R0603  [R0603]
R27  10K  CROWPANEL_ADVANCE_HMI_RES-0402  [CROWPANEL_ADVANCE_HMI_R0402]
R28  10K  CROWPANEL_ADVANCE_HMI_RES-0402  [CROWPANEL_ADVANCE_HMI_R0402]
R29  10K  CROWPANEL_ADVANCE_HMI_RES-0402  [CROWPANEL_ADVANCE_HMI_R0402]
R30  10K  CROWPANEL_ADVANCE_HMI_RES-0402  [CROWPANEL_ADVANCE_HMI_R0402]
R31  27K  RES-0603  [R0603-SP]
R32  2K  RES-0603  [R0603-SP]
R33  NC  CROWPANEL_ADVANCE_HMI_RES-0402  [CROWPANEL_ADVANCE_HMI_R0402]
R34  NC  RES-0402  [R0402]
R35  NC/10M  RES-0402  [R0402]
R36  0R  RES-0402  [R0402]
R37  0R  RES-0402  [R0402]
R38  0R  RES-0402  [R0402]
R39  0R  RES-0402  [R0402]
R40  0R  RES-0402  [R0402]
R41  0R  RES-0402  [R0402]
R42  0R  RES-0402  [R0402]
R43  0R  RES-0402  [R0402]
R44  0R  RES-0402  [R0402]
R45  4.7K  R0603  [R0603]
R46  4.7K  R0603  [R0603]
R47  5.1K  R0603  [R0603]
R48  0R  CROWPANEL_ADVANCE_HMI_RES-0402  [CROWPANEL_ADVANCE_HMI_R0402]
R49  0R  CROWPANEL_ADVANCE_HMI_RES-0402  [CROWPANEL_ADVANCE_HMI_R0402]
R50  5.1K  R0603  [R0603]
R51  4.7K  R0603  [R0603]
R52  4.7K  R0603  [R0603]
R53  2K  COOPER_R0603  [COOPER_R0603]
R54  10K  CROWPANEL_ADVANCE_HMI_RES-0402  [CROWPANEL_ADVANCE_HMI_R0402]
R55  0R  CROWPANEL_ADVANCE_HMI_RES-0402  [CROWPANEL_ADVANCE_HMI_R0402]
R56  4.7K  R0603  [R0603]
R57  4.7K  R0603  [R0603]
R58  4.7K  R0603  [R0603]
R59  4.7K  R0603  [R0603]
R60  0R  CROWPANEL_ADVANCE_HMI_RES-0402  [CROWPANEL_ADVANCE_HMI_R0402]
R61  10K  CROWPANEL_ADVANCE_HMI_RES-0402  [CROWPANEL_ADVANCE_HMI_R0402]
R62  4.7K  R0603  [R0603]
R63  0R  RES-0402  [R0402]
R64  0R  RES-0402  [R0402]
R65  10K  RES-0402  [R0402]
R66  10K  CROWPANEL_ADVANCE_HMI_RES-0402  [CROWPANEL_ADVANCE_HMI_R0402]
R67  10K  CROWPANEL_ADVANCE_HMI_RES-0402  [CROWPANEL_ADVANCE_HMI_R0402]
R68  22R  RES-0402  [R0402]
R69  0R  CROWPANEL_ADVANCE_HMI_RES-0402  [CROWPANEL_ADVANCE_HMI_R0402]
R70  0R  RES-0402  [R0402]
R71  10K  CROWPANEL_ADVANCE_HMI_RES-0402  [CROWPANEL_ADVANCE_HMI_R0402]
R72  0R  CROWPANEL_ADVANCE_HMI_RES-0402  [CROWPANEL_ADVANCE_HMI_R0402]
R73  10K  CROWPANEL_ADVANCE_HMI_RES-0402  [CROWPANEL_ADVANCE_HMI_R0402]
R74  27K  RES-0603  [R0603-SP]
R75  NC  R0603  [R0603]
R76  0R  R0603  [R0603]
R77  10K  CROWPANEL_ADVANCE_HMI_RES-0402  [CROWPANEL_ADVANCE_HMI_R0402]
R78  4.7K  R0603  [R0603]
R79  NC  CROWPANEL_ADVANCE_HMI_RES-0402  [CROWPANEL_ADVANCE_HMI_R0402]
R80  0R  RES-0402  [R0402]
R81  51K  CROWPANEL_ADVANCE_HMI_RES-0402  [CROWPANEL_ADVANCE_HMI_R0402]
R82  51K  CROWPANEL_ADVANCE_HMI_RES-0402  [CROWPANEL_ADVANCE_HMI_R0402]
R83  51K  CROWPANEL_ADVANCE_HMI_RES-0402  [CROWPANEL_ADVANCE_HMI_R0402]
R84  51K  CROWPANEL_ADVANCE_HMI_RES-0402  [CROWPANEL_ADVANCE_HMI_R0402]
R85  51K  CROWPANEL_ADVANCE_HMI_RES-0402  [CROWPANEL_ADVANCE_HMI_R0402]
R86  51K  CROWPANEL_ADVANCE_HMI_RES-0402  [CROWPANEL_ADVANCE_HMI_R0402]
R87  10K  CROWPANEL_ADVANCE_HMI_RES-0402  [CROWPANEL_ADVANCE_HMI_R0402]
R88  0R  CROWPANEL_ADVANCE_HMI_RES-0402  [CROWPANEL_ADVANCE_HMI_R0402]
R89  0R  CROWPANEL_ADVANCE_HMI_RES-0402  [CROWPANEL_ADVANCE_HMI_R0402]
R90  0R  CROWPANEL_ADVANCE_HMI_RES-0402  [CROWPANEL_ADVANCE_HMI_R0402]
R91  10K  CROWPANEL_ADVANCE_HMI_RES-0402  [CROWPANEL_ADVANCE_HMI_R0402]
R92  0R  R0603  [R0603]
R93  4.7K  R0603  [R0603]
R94  4.7K  R0603  [R0603]
R95  0R  RES-0402  [R0402]
R96  5.1K  CROWPANEL_ADVANCE_HMI_RES-0402  [CROWPANEL_ADVANCE_HMI_R0402]
R97  4.7K  R0603  [R0603]
R98  4.7K  R0603  [R0603]
R99  22R  RES-0402  [R0402]
R100  22R  RES-0402  [R0402]
R101  5.1K  CROWPANEL_ADVANCE_HMI_RES-0402  [CROWPANEL_ADVANCE_HMI_R0402]
R103  0R  CROWPANEL_ADVANCE_HMI_RES-0402  [CROWPANEL_ADVANCE_HMI_R0402]
R105  0R  RES-0402  [R0402]
R106  10K  CROWPANEL_ADVANCE_HMI_RES-0402  [CROWPANEL_ADVANCE_HMI_R0402]
R107  0R_NC  RES-0402  [R0402]
R109  NC  RES-0402  [R0402]
R110  NC  RES-0402  [R0402]
R111  0R  RES-0402  [R0402]
R112  0R  CROWPANEL_ADVANCE_HMI_RES-0402  [CROWPANEL_ADVANCE_HMI_R0402]
R113  0R  CROWPANEL_ADVANCE_HMI_RES-0402  [CROWPANEL_ADVANCE_HMI_R0402]
R114  0R  CROWPANEL_ADVANCE_HMI_RES-0402  [CROWPANEL_ADVANCE_HMI_R0402]
R115  0R  CROWPANEL_ADVANCE_HMI_RES-0402  [CROWPANEL_ADVANCE_HMI_R0402]
R116  10K  CROWPANEL_ADVANCE_HMI_RES-0402  [CROWPANEL_ADVANCE_HMI_R0402]
R117  100K  CROWPANEL_ADVANCE_HMI_RES-0402  [CROWPANEL_ADVANCE_HMI_R0402]
R118  0R  CROWPANEL_ADVANCE_HMI_RES-0402  [CROWPANEL_ADVANCE_HMI_R0402]
R119  0R  CROWPANEL_ADVANCE_HMI_RES-0402  [CROWPANEL_ADVANCE_HMI_R0402]
R120  5.1K_NC  R0603  [R0603]
R121  5.1K_NC  R0603  [R0603]
R122  NC  RES-0402  [R0402]
R129  0R  CROWPANEL_ADVANCE_HMI_RES-0402  [CROWPANEL_ADVANCE_HMI_R0402]
R133  0R  RES-0402  [R0402]
R135  0R  RES-0402  [R0402]
R139  100K  CROWPANEL_ADVANCE_HMI_RES-0402  [CROWPANEL_ADVANCE_HMI_R0402]
R143  47K  CROWPANEL_ADVANCE_HMI_RES-0402  [CROWPANEL_ADVANCE_HMI_R0402]
R149  0R  CROWPANEL_ADVANCE_HMI_RES-0402  [CROWPANEL_ADVANCE_HMI_R0402]
R152  100R  RES-0402  [R0402]
R153  100R  RES-0402  [R0402]
R154  100R  RES-0402  [R0402]
R155  100R  RES-0402  [R0402]
R156  100R  RES-0402  [R0402]
R157  100R  RES-0402  [R0402]
R158  4.02K  RES-0402  [R0402]
R159  3.6R  RES-0603  [R0603-SP]
R160  10K  CROWPANEL_ADVANCE_HMI_RES-0402  [CROWPANEL_ADVANCE_HMI_R0402]
R164  39k  CROWPANEL_ADVANCE_HMI_RES-0402  [CROWPANEL_ADVANCE_HMI_R0402]
R176  NC  RES-0402  [R0402]
R180  NC  CROWPANEL_ADVANCE_HMI_RES-0402  [CROWPANEL_ADVANCE_HMI_R0402]
R181  10K  CROWPANEL_ADVANCE_HMI_RES-0402  [CROWPANEL_ADVANCE_HMI_R0402]
R183  0R  RES-0603  [R0603-SP]
R184  0R  R0603  [R0603]
R186  100k  CROWPANEL_ADVANCE_HMI_RES-0402  [CROWPANEL_ADVANCE_HMI_R0402]
R187  10k  CROWPANEL_ADVANCE_HMI_RES-0402  [CROWPANEL_ADVANCE_HMI_R0402]
R188  22R  RES-0402  [R0402]
R189  22R  RES-0402  [R0402]
R191  10K  RES-0402  [R0402]
R192  0R  CROWPANEL_ADVANCE_HMI_RES-0402  [CROWPANEL_ADVANCE_HMI_R0402]
R210  NC/10K  CROWPANEL_ADVANCE_HMI_RES-0402  [CROWPANEL_ADVANCE_HMI_R0402]
S1  DSIC-01-TS-GER  [SW_SMD2_DSIC-01-TS-GER]
SW1  switch_6pin  SWITCH_6PIN_2P  [SWITCH_6PIN_2P]
U1  CH340K  [ESOP-10-EP-150MIL]
U2  TP4059-SOT23-6  [SOT23-6L]
U3  NS4168  NS4168-ESOP-8  [NS4168-ESOP-8]
U5  SGM3005XMSTR  [MSOP-10]
U6  MT9201  COOPER_MT9201  [COOPER_SOT23-6]
U7  ESP32-P4NRW32  [IC_ESP32-P4NRW32]
U8  UMH3NTN  [SOP65P210X100-6N]
U9  MT3406_C22462728  TLV62569DBVR  [SOT95P280X145-5N]
U10  MT3406_C22462728  TLV62569DBVR  [SOT95P280X145-5N]
U13  NS4168  NS4168-ESOP-8  [NS4168-ESOP-8]
U14  STC8H1K17-36I  STC8H1K08-36I  [TSSOP20]
U175  MMICT5838-00-012_LMD3526B261-OFA03  [MMICT5838-00-012_MIC-SMD_5P-L3.5-W2.7-P1.67]
Y2  40MHZ  X322540MPB4SI  [X322540MPB4SI]
Y3  24Mhz  24MHZ  [24MHZ_1631-24003-BTKEYA]
Y4  32.768K  NORDIC_NRF_XTAL_32KHZ  [NORDIC_NRF_XTAL_3215_N]

## Nets
3V3$: C2.2 U1.10(V3)
13: R189.1 U14.3(MISO/P1.4)
14: R188.1 U14.4(SCLK/P1.5)
+5V_IN: D2.+ D4.+ J10.3 P63.P$1 R46.1 R51.1
+VBUS1: D10.+ D11.+ J1.A4 J1.A9 J1.B4 J1.B9 P1.P$1
+VBUS2: D007.+ D008.+ J16.A4 J16.A9 J16.B4 J16.B9
ADC_VBAT: C158.2 R164.2 R186.1 U14.13(P3.2/ADC10)
AGND: C102.2 C103.2 C104.2 C105.1 C106.1 FB19.2 J4.P$3 J4.P$4 R143.2 U13.7(GND) U13.9(PE)
AGND1: C25.1 R176.2 R183.2 U175.5_1(GND) U175.5_2(GND)
AGND3: C22.2 C23.2 C24.2 C67.1 C68.1 FB20.2 J6.P$3 J6.P$4 U3.7(GND) U3.9(PE)
AUDIO_CTRL: Q10.3(D) R117.1 R139.1
AUDIO_OUT_SD_P10: Q10.1(G) R71.1 U14.19(P1.0/ADC0)
AUDIO_VDD1: C102.1 C103.1 C104.1 FB17.1 U13.6(VDD)
AUDIO_VDD2: C22.1 C23.1 C24.1 FB18.1 U3.6(VDD)
AUDIO_VDD_3V3: C152.2 C153.2 FB1.1 FB16.2 IC7.5(VOUT)
AVDD_2V8: C82.2 C83.2 FPC3.1 FPC3.2 IC3.5(VOUT)
C6_EN_IO20: C15.1 IC1.8(EN) R77.1 R95.2
C6_IO8: IC1.22(IO8) R87.2
C6_IO9_BOOT: IC1.23(IO9) P36.P$1
C6_RXD0: IC1.30(RXD0) P21.P$1
C6_TXD0: IC1.31(TXD0) P25.P$1
C6_VDD_3V3: C11.1 C14.2 IC1.3(3V3) P37.P$1 R76.1 R77.2 R81.1 R82.1 R83.1 R84.1 R85.1 R86.1 R87.1
CSI_CLK_N: FPC3.19 R156.2
CSI_CLK_P: FPC3.18 R157.2
CSI_D0_N: FPC3.16 R152.2
CSI_D0_P: FPC3.15 R153.2
CSI_D1_N: FPC3.22 R154.2
CSI_D1_P: FPC3.21 R155.2
CSI_RESET: FPC3.8 Q4.2(S) R57.2
CSI_RESET_P13: Q4.3(D) R58.2 U14.2(MOSI/P1.3)
CSI_SCL: FPC3.4 Q7.2(S) R62.2
CSI_SDA: FPC3.5 Q6.2(S) R56.2
CSID0_P: R153.1 U7.43(CSI_DATAP0)
DA1: J5.8(DATA1) R15.1
DA2: J5.1(DATA2) R30.1
DOVDD_1V8: C77.2 C78.2 C84.2 C85.2 FPC3.9 IC2.5(VOUT) Q4.1(G) Q6.1(G) Q7.1(G) R56.1 R57.1 R62.1 R67.2 Y3.4(4_VDD)
DOWNLOAD_BOOT: R60.1 R69.2 R106.2
DTR: R5.2 U1.4(DTR#) U8.4(E2)
EN_DCDC: R13.2 U7.79(EN_DCDC)
ESP32_LDO1: C58.1 R105.2 U7.71(VFB1/VO1)
ESP32_LDO2: C57.1 R40.2 U7.72(VFB2/VO2)
ESP32_LDO3: C59.1 R80.2 U7.73(VFB3/VO3)
ESP32_LDO4: C66.1 R109.2 U7.74(VFB4/VO4)
FB_DCDC: C31.1 R14.2 R21.1 R103.1 U10.5(FB)
FLASH_CK: IC4.6(CLK) U7.32(FLASH_CK)
FLASH_CS: IC4.1(/CS) R65.1 U7.27(FLASH_CS)
FLASH_D: IC4.5(DI_(IO0)) U7.33(FLASH_D)
FLASH_HOLD: IC4.7(/HOLD_OR_/RESET_(IO3)) U7.31(FLASH_HOLD)
FLASH_Q: IC4.2(DO_(IO1)) U7.28(FLASH_Q)
FLASH_WP: IC4.3(/WP_(IO2)) U7.29(FLASH_WP)
GND [GND]: C1.1 C2.1 C3.1 C4.1 C5.2 C6.1 C7.2 C8.1 C9.2 C10.1 C11.2 C12.2 C13.2 C14.1 C15.2 C17.1 C18.2 C19.2 C27.1 C28.2 C29.2 C30.2 C32.1 C33.2 C34.1 C35.1 C36.2 C39.2 C40.2 C41.2 C42.1 C43.2 C44.1 C45.2 C46.2 C47.1 C48.1 C49.1 C50.2 C51.2 C53.1 C54.1 C55.2 C56.1 C57.2 C58.2 C59.2 C60.2 C61.2 C62.2 C63.2 C64.2 C65.2 C66.2 C69.1 C70.2 C71.1 C73.2 C74.1 C75.1 C76.1 C77.1 C78.1 C79.1 C80.1 C81.1 C82.1 C83.1 C84.1 C85.1 C86.1 C87.2 C88.2 C89.1 C107.1 C108.2 C112.1 C113.2 C114.1 C115.2 C116.1 C136.1 C144.1 C149.1 C150.1 C151.1 C152.1 C153.1 C155.1 C156.1 C157.1 C158.1 C159.1 C160.1 C161.1 C162.1 C163.1 D14.- FB19.1 FB20.1 FPC2.4 FPC2.7 FPC2.8 FPC3.3 FPC3.6 FPC3.10 FPC3.12 FPC3.17 FPC3.20 FPC3.25 FPC3.26 IC1.1(GND_1) IC1.2(GND_2) IC1.11(GND_3) IC1.14(GND_4) IC1.36(GND_5) IC1.37(GND_6) IC1.38(GND_7) IC1.39(GND_8) IC1.40(GND_9) IC1.41(GND_10) IC1.42(GND_11) IC1.43(GND_12) IC1.44(GND_13) IC1.45(GND_14) IC1.46(GND_15) IC1.47(GND_16) IC1.48(GND_17) IC1.49(GND_18) IC1.50(GND_19) IC1.51(GND_20) IC1.52(GND_21) IC1.53(GND_22) IC1.54(GND_23) IC1.55(GND_24) IC1.56(GND_25) IC1.57(GND_26) IC1.58(GND_27) IC1.59(GND_28) IC1.60(GND_29) IC1.61(GND_30) IC2.2(VSS) IC3.2(VSS) IC4.4(GND) IC7.2(VSS) IC8.2(VSS) J1.A1 J1.A12 J1.B1 J1.B12 J1.P$1 J1.P$2 J1.P$3 J1.P$4 J2.4 J2.SS1 J2.SS2 J3.P$2 J3.P$3 J3.P$4 J5.6(VSS) J5.G1 J5.G2 J5.G3 J5.G4 J7.11 J7.13 J7.14 J7.15 J7.16 J8.4 J9.6 J9.6-6 J10.4 J10.5(SS1) J10.6(SS2) J12.P$1 J13.4 J13.SS1 J13.SS2 J14.P$1 J15.P$1 J16.A1 J16.A12 J16.B1 J16.B12 J16.P$1 J16.P$2 J16.P$3 J16.P$4 J17.P$1 JP1.P$5(GND2) JP1.P$12(GND4) JP1.P$18(B2) JP1.P$19(B1) JP1.P$20(B0) JP1.P$27(G1) JP1.P$28(G0) JP1.P$34(R2) JP1.P$35(R1) JP1.P$36(R0) JP1.P$38(GND3) JP1.P$41(GND5) JP1.P$42(GND6) K3.1 K4.1 P4.P$1 P10.P$1 P12.P$1 P28.P$1 P30.P$1 P31.P$1 P60.P$1 P70.P$1 P71.P$1 P76.P$1 P80.P$1 P81.P$1 R3.1 R4.2 R11.2 R16.1 R18.1 R21.2 R33.2 R73.1 R74.2 R96.1 R101.2 R158.2 R159.1 R160.2 R183.1 R186.2 SW1.1(1_2B) SW1.6(6_1B) U1.3(GND) U1.EP U2.2(GND) U5.6(GND) U6.2(2-GND) U7.105(GND) U9.2(GND) U10.2(GND) U14.10(GND) Y2.2(GND_1) Y2.4(GND_2) Y3.2(2_GND)
I2C1_SCL: P18.P$1 Q9.2(S) R64.2 R97.2 U7.88(GPIO46)
I2C1_SCL_3V3: J11.2 J11.2-2 J13.1 P62.P$1 Q9.3(D) R93.2 R188.2
I2C1_SDA: P19.P$1 Q8.2(S) R63.2 R98.2 U7.87(GPIO45)
I2C1_SDA_3V3: J11.3 J11.3-3 J13.2 P61.P$1 Q8.3(D) R94.2 R189.2
I2C2_SCL: Q7.3(D) R59.2 U7.65(GPIO34)
I2C2_SDA: Q6.3(D) R22.2 U7.64(GPIO33)
I2S_LRCK: R114.1 R149.1 U7.23(GPIO21)
I2S_SCLK: R113.1 R129.1 U7.24(GPIO22)
I2S_SDOUT: R112.1 R115.1 U7.25(GPIO23)
I2SOUT_LRCK1: R149.2 U13.2(LRCLK)
I2SOUT_LRCK2: P35.P$1 R114.2 U3.2(LRCLK)
I2SOUT_SCLK1: R129.2 U13.3(BCLK)
I2SOUT_SCLK2: P34.P$1 R113.2 U3.3(BCLK)
I2SOUT_SD1: R112.2 U13.4(SDATA)
I2SOUT_SD2: P33.P$1 R115.2 U3.4(SDATA)
IO29_W: J7.6 J11.5 J11.5-5 P23.P$1 U7.58(GPIO29)
IO30_W_BUSY: J7.8 J11.6 J11.6-6 P22.P$1 U7.60(GPIO30)
LCD_3V3: C160.2 C161.2 C162.2 C163.2 FPC2.5 JP1.P$37(VCC) P40.P$1 P72.P$1 R92.1 R191.2
LCD_B3_IO8: JP1.P$17(B3) P52.P$1 U7.8(GPIO8)
LCD_B4_IO7: JP1.P$16(B4) P53.P$1 U7.7(GPIO7)
LCD_B5_IO6: JP1.P$15(B5) P56.P$1 U7.6(GPIO6)
LCD_B6_IO5: JP1.P$14(B6) P57.P$1 U7.5(GPIO5)
LCD_B7_IO4: JP1.P$13(B7) P65.P$1 U7.4(GPIO4)
LCD_BK_EN_P11: R72.1 U14.20(P1.1/ADC1)
LCD_BK_POWER_P37: R79.1 R180.1 U14.18(P3.7/INT3)
LCD_BK_VDD: C13.1 C17.2 L5.1 Q11.3(D) R184.2 U6.6(6-VIN)
LCD_CLK_IO3: JP1.P$11(CLK) P66.P$1 R68.2
LCD_DE_IO2: JP1.P$7(DE) P69.P$1 U7.2(GPIO2)
LCD_G2_IO14: JP1.P$26(G2) P46.P$1 U7.15(GPIO14)
LCD_G3_IO13: JP1.P$25(G3) P47.P$1 U7.14(GPIO13)
LCD_G4_IO12: JP1.P$24(G4) P48.P$1 U7.13(GPIO12)
LCD_G5_IO11: JP1.P$23(G5) P49.P$1 U7.12(GPIO11)
LCD_G6_IO10: JP1.P$22(G6) P50.P$1 U7.11(GPIO10)
LCD_G7_IO9: JP1.P$21(G7) P51.P$1 U7.10(GPIO9)
LCD_HSYNC_IO40: JP1.P$9(HSYNC) P67.P$1 U7.81(GPIO40)
LCD_LED+: C18.1 C19.1 D003.- JP1.P$39(LEDA) P39.P$1 U6.5(5-OV)
LCD_LED-: JP1.P$40(LEDK) P38.P$1 R159.2 U6.3(3-FB)
LCD_R3_IO19: JP1.P$33(R3) P41.P$1 U7.20(GPIO19)
LCD_R4_IO18: JP1.P$32(R4) P42.P$1 U7.19(GPIO18)
LCD_R5_IO17: JP1.P$31(R5) P43.P$1 U7.18(GPIO17)
LCD_R6_IO16: JP1.P$30(R6) P44.P$1 U7.17(GPIO16)
LCD_R7_IO15: JP1.P$29(R7) P45.P$1 U7.16(GPIO15)
LCD_VSYNC_IO41: JP1.P$8(VSYNC) P68.P$1 U7.82(GPIO41)
MIC1_1: R133.2 U175.1(DATA)
MIC1_2: R34.1 R176.1 U175.2(L/R)
MIC1_3: R135.1 U175.3(CLK)
MIC1_VDD_3V3: C25.2 FB1.2 R34.2 U175.4(VDD)
MIC_MCLK1_IO24: P27.P$1 R135.2 U7.52(GPIO24)
MIC_SD1_IO25: P29.P$1 R133.1 U7.53(GPIO25)
N$1: R1.1 U9.1(EN)
N$2: L1.1 U9.3(SW)
N$3: R55.2 U7.66(GPIO35)
N$4: FB10.1 U13.8(VOP)
N$5: R6.1 U1.1(UD+)
N$6: R7.1 U1.2(UD-)
N$7: R5.1 U8.2(B1)
N$8: R9.1 U8.5(B2)
N$9: J1.B5 R3.2
N$10: R8.2 U1.9(RXD)
N$11: R10.2 U1.8(TXD)
N$12: R16.2 U2.6(PRO)
N$13: C26.1 R2.2 R11.1 U9.5(FB)
N$14: L6.1 U10.3(SW)
N$15: C151.2 IC7.3(CE) R181.1
N$16: R13.1 R210.2 U10.1(EN)
N$17: FPC2.1 R64.1
N$18: FPC2.2 R63.1
N$19: D1.3 R31.1 R121.1
N$20: D1.4 R32.1 R120.1
N$21: D14.+ R26.1
N$22: C159.2 R187.2 R192.2 U14.7(NRST/PWM6/P5.4)
N$23: J9.1 J9.1-1 R49.1
N$24: J11.1 J11.1-1 R48.1
N$25: C30.1 R35.1 U7.1(GPIO1) Y4.2
N$26: Q5.4(4_G) R78.1 SW1.2(2_COM2) SW1.5(5_COM1)
N$27: J1.A5 R4.1
N$28: Q11.1(G) R79.2
N$29: C28.1 R24.1 R210.1 U10.4(VIN)
N$30: C29.1 R35.2 U7.104(GPIO0) Y4.1
N$31: JP1.P$10(DISP) R191.1
N$32: R68.1 U7.3(GPIO3)
N$33: R72.2 R160.1 U6.4(4-EN)
N$34: R99.2 U7.49(DM)
N$35: R100.2 U7.50(DP)
N$36: R95.1 U7.22(GPIO20)
N$41: R103.2 U7.78(FB_DCDC)
N$45: FB2.1 U3.8(VOP)
N$46: FB11.1 U13.5(VON)
N$47: FB3.1 U3.5(VON)
N$48: R117.2 U3.1(CTRL)
N$49: R118.2 U14.12(P3.1/ADC9)
N$50: R119.2 U14.11(P3.0/ADC8)
N$51: R139.2 R143.1 U13.1(CTRL)
N$55: C155.2 IC8.3(CE) R116.1
N$68: R158.1 U7.48(CSI_REXT)
N$69: R157.1 U7.44(CSI_CLKP)
N$70: R156.1 U7.45(CSI_CLKN)
N$71: R155.1 U7.47(CSI_DATAP1)
N$72: R154.1 U7.46(CSI_DATAN1)
N$73: R152.1 U7.42(CSI_DATAN0)
N$75: J16.B5 R96.2
N$76: J16.A5 R101.1
N$83: C76.2 IC2.3(CE) R61.1
N$84: C81.2 IC3.3(CE) R66.1
N$85: C86.2 R67.1 Y3.1(1_EN)
N$121: D003.+ L5.2 U6.1(1-SW)
P4_IO36: R60.2 U7.68(GPIO36)
P4_IO39: R90.2 U7.80(GPIO39)
P4_IO43: R88.2 U7.84(GPIO43)
P4_IO44: R89.2 U7.86(GPIO44)
P4_RST_EN: C35.2 K4.2 R54.2 R192.1 U7.103(CHIP_PU) U8.6(C1)
P4_RXD1_IO48: J2.1 P79.P$1 U5.5(NC1)
P4_RXD2_IO32: J7.12 P59.P$1 R48.2 U7.63(GPIO32)
P4_TXD1_IO47: J2.2 P78.P$1 U5.7(NC2)
P4_TXD2_IO31: J7.10 P58.P$1 R49.2 U7.61(GPIO31)
P4_VBAT: C9.1 C42.2 R20.1 U7.102(VBAT)
POWER_CHRG: R50.1 R120.2 U2.1(CHG) U14.14(P3.3/ADC11)
POWER_DONE: R47.1 R121.2 U2.5(STD) U14.15(P3.4/ADC11)
POWER_G_LED: R31.2 U14.17(P3.6/ADC14)
POWER_R_LED: R32.2 U14.16(P3.5/ADC13)
RTS: R9.2 U1.6(RTS#) U8.1(E1)
RXD0: R10.1 U7.70(GPIO38)
RXD1_MOSI_IO48: J7.9 U5.3(COM1) U7.90(GPIO48)
RXD3: Q2.2(S) R45.2 U7.57(GPIO28)
SD1_CMD_IO44: J5.3(DI) P8.P$1 R28.1 R89.1
SD1_D0_IO39: J5.7(DO) P6.P$1 R27.1 R90.1
SD1_SCK_IO43: J5.5(SCLK) P7.P$1 R88.1
SD2_CLK: IC1.25(IO19) R82.2 U7.97(GPIO53)
SD2_CMD: IC1.24(IO18) R81.2 U7.98(GPIO54)
SD2_D0: IC1.26(IO20) R83.2 U7.95(GPIO52)
SD2_D1: IC1.27(IO21) R84.2 U7.94(GPIO51)
SD2_D2: IC1.28(IO22) R85.2 U7.93(GPIO50)
SD2_D3: IC1.29(IO23) R86.2 U7.92(GPIO49)
SDCS: J5.2(CS) R29.1 R33.1
SEL0: R53.2 R73.2 S1.2 U5.4(IN1) U5.8(IN2)
SPI2_MISO_IO47: J9.3 J9.3-3 P15.P$1 U5.10(NO2)
SPI2_MOSI_IO48: J9.4 J9.4-4 P14.P$1 U5.2(NO1)
SPI2_SCK_IO26: J7.5 J9.2 J9.2-2 P16.P$1 U7.55(GPIO26)
SPI_BOOT: C54.2 K3.2 R55.1 R91.2 U8.3(C2)
STC8_RXD: J8.2 R119.1
STC8_TXD: J8.1 R118.1
STC8_VDD_3V3: C69.2 C156.2 C157.2 D1.1 D1.2 IC8.5(VOUT) J8.3 R58.1 R187.1 U14.8(VCC) U14.9(VREF)
SW_SPI_UART_P17: R53.1 U14.6(XTALI/P1.7)
TP_INT_IO42: FPC2.3 P20.P$1 R75.2 U7.83(GPIO42)
TP_RST: FPC2.6 P73.P$1 R74.1 R111.1 R122.1
TP_RST_IO36: R69.1 R111.2
TP_RST_P12: R122.2 U14.1(SS/P1.2)
TXD0: R8.1 U7.69(GPIO37)
TXD1_MISO_IO47: J7.7 U5.9(COM2) U7.89(GPIO47)
TXD3: Q1.2(S) R52.2 U7.56(GPIO27)
UART_IN_RXD3: J10.2 P64.P$1 Q2.3(D) R46.2
UART_IN_TXD3: J10.1 P74.P$1 Q1.3(D) R51.2
USB1_D+: J1.A6 J1.B6 P2.P$1 R6.2
USB1_D-: J1.A7 J1.B7 P3.P$1 R7.2
USB2_D+: J16.A6 J16.B6 R100.1
USB2_D-: J16.A7 J16.B7 R99.1
VBAT: C4.2 J3.P$1 P9.P$1 Q3.5(5_D) Q3.6(6_D) Q3.7(7_D) Q3.8(8_D) Q3.9(9_D) R17.1 R164.1 U2.3(BAT)
VCC5V: C136.2 C144.2 D2.- D007.- D10.- IC8.1(VIN) P11.P$1 Q3.1(1_S) Q3.2(2_S) Q3.3(3_S) Q5.1(1_S) Q5.2(2_S) Q5.3(3_S) R78.2 R116.2
VCC5V_IN: C3.2 D4.- D008.- D11.- Q3.4(4_G) R17.2 R18.2 R47.2 R50.2 U2.4(VCC)
VCCA: C43.1 C47.2 R23.1 U7.51(VCCA)
VDD5V: C12.1 C149.2 C150.2 FB17.2 FB18.2 IC7.1(VIN) J7.2 J7.4 L4.2 P5.P$1 Q5.5(5_D) Q5.6(6_D) Q5.7(7_D) Q5.8(8_D) Q5.9(9_D) Q11.2(S) R1.2 R24.2 R26.2 R180.2 R181.2 R184.1 U9.4(VIN)
VDD5V_W: C88.1 J9.7 J9.7-7 L4.1
VDD_1V2: C31.2 C32.2 L6.2 P24.P$1 R14.1 R42.2 R43.2 R44.2
VDD_3V3: C1.2 C10.2 C26.2 C27.2 C53.2 C70.1 C74.2 C75.2 C79.2 C80.2 C89.2 FB16.1 IC2.1(VIN) IC3.1(VIN) J2.3 J5.4(VDD) J7.1 J7.3 J9.5 J9.5-5 J13.3 L1.2 P13.P$1 P17.P$1 P75.P$1 P77.P$1 Q1.1(G) Q2.1(G) Q10.2(S) R2.1 R12.2 R15.2 R19.2 R20.2 R23.2 R25.2 R27.2 R28.2 R29.2 R30.2 R36.2 R37.2 R38.2 R39.2 R41.2 R45.1 R52.1 R54.1 R61.2 R66.2 R70.2 R71.2 R76.2 R91.1 R92.2 R93.1 R94.1 R106.1 R107.2 R110.2 S1.1 U1.7(VCC) U5.1(V+)
VDD_FLASH: C39.1 C40.1 C51.1 IC4.8(VCC) R65.2 R105.1 R107.1
VDD_HP_0: C108.1 C112.2 R42.1 U7.26(VDD_HP_0)
VDD_HP_2: C113.1 C114.2 R43.1 U7.76(VDD_HP_2)
VDD_HP_3: C115.1 C116.2 R44.1 U7.91(VDD_HP_3)
VDD_MIPI_DPHY: C62.1 C63.1 C64.1 R80.1 U7.41(VDD_MIPI_DPHY)
VDDA: C7.1 C8.2 R19.1 U7.101(VDDA)
VDDPST: C36.1 C55.1 R40.1 R110.1 U7.59(VDDPST) U7.67(VDDPST)
VDDPST_1: C73.1 C107.2 R36.1 U7.9(VDDPST_1)
VDDPST_2: C41.1 C44.2 R37.1 U7.21(VDDPST_2)
VDDPST_3: C45.1 C49.2 R38.1 U7.30(VDDPST_3)
VDDPST_4: C50.1 C56.2 R39.1 U7.62(VDDPST_4)
VDDPST_5: C60.1 C65.1 Q8.1(G) Q9.1(G) R22.1 R25.1 R59.1 R75.1 R97.1 R98.1 R109.1 U7.85(VDDPST_5)
VDDPST_6: C61.1 C71.2 R41.1 U7.96(VDDPST_6)
VDDPST_DCDC: C5.1 C6.2 R12.1 U7.77(VDDPST_DCDC)
VDDPST_LDO: C46.1 C48.2 R70.1 U7.75(VDDPST_LDO)
VOLN: C106.2 FB11.2 J4.P$2 P55.P$1
VOLP: C105.2 FB10.2 J4.P$1 P54.P$1
VORN: C68.2 FB3.2 J6.P$2 P32.P$1
VORP: C67.2 FB2.2 J6.P$1 P26.P$1
XTAL_N: C34.2 U7.99(XTAL_N) Y2.3(CRYSTAL_2)
XTAL_P: C33.1 U7.100(XTAL_P) Y2.1(CRYSTAL_1)
XVCLK: C87.1 FPC3.11 Y3.3(3_OUT)
Unconnected: FPC3.7 FPC3.13 FPC3.14 FPC3.23 FPC3.24 IC1.4(NC_1) IC1.5(IO2) IC1.6(IO3) IC1.7(NC_2) IC1.9(IO4) IC1.10(IO5) IC1.12(IO0) IC1.13(IO1) IC1.15(IO6) IC1.16(IO7) IC1.17(IO12) IC1.18(IO13) IC1.19(IO14) IC1.20(IO15) IC1.21(NC_3) IC1.32(NC_4) IC1.33(NC_5) IC1.34(NC_6) IC1.35(NC_7) IC2.4(NC) IC3.4(NC) IC7.4(NC) IC8.4(NC) J1.A8 J1.B8 J5.9(CDN) J11.4 J11.4-4 J11.7 J11.7-7 J16.A8 J16.B8 JP1.P$1(YU) JP1.P$2(XL) JP1.P$3(YD) JP1.P$4(XR) JP1.P$6(NC) SW1.3(3_2A) SW1.4(4_1A) U1.5(CTS#) U7.34(DSI_REXT) U7.35(DSI_DATAP1) U7.36(DSI_DATAN1) U7.37(DSI_CLKN) U7.38(DSI_CLKP) U7.39(DSI_DATAP0) U7.40(DSI_DATAN0) U7.54(NC) U14.5(XTALO/P1.6)

## Notes on the sheet
- USB interface | USB TO UART | UART & I2C & GPIO extensions
- ESP32-C6
- 5.0 inch IPS interface
- UART_5V_IN | UART0_OUT
- I2C_OUT
- Battery and control
- BOOT
- CSI_Interface | ESP32-P4
- HIG: SPI Boot
- LOW: Download Boot
- RESET
- HIG: ESP32-P4 Enable
- LOW: ESP32-P4 Off
- Charge indicator control | Power_LED | SD card
- Power SW
- ESP32-P4_POWER
- Wireless module
- DC-DC:5V to 3V3 | DC-DC:5V to 1V2 | LDO:5V to 3V3(AUDIO POWER)
- LCD_LED Driver
- 2A
- 2A
- I led=200mV/3.6=55.5mA
- PDM MIC
- Function switching
- Audio_OUT

## Library data of the parts
C1-C4 C12 C17 C19 C22 C28 C67 C68 C70 C74 C75 C77-C80 C82 C83 C88 C102 C105 C106 C136 C144 C155-C157 = RC:C0603
C5-C9 C25 C29 C30 C33 C34 C36 C39-C51 C53 C55-C66 C71 C73 C87 C89 C107 C108 C112-C116 = LoraWAN_Gateway_Mainboard:CAP*
C10 C11 C14 C15 C26 C31 C35 C54 C69 C76 C81 C84 C86 C151 C158-C163 = ESP32 Display 5.0 inch V1.2:CROWPANEL_ADVANCE_HMI_CAP*
C13 C18 = RC:C0805
C23 C24 C103 C104 = ESP32-P4 Display 7.0 inch V0.2:RC_C0805
C27 C32 C85 C149 C150 C152 C153 = ESP32-P4 Display 7.0 inch V0.2:COOPER_C0603
D1 = KT-0603RYG:KT-0603RYG: Check availability <https://pricing.snapeda.com/parts/KT-0603R/Hubei%20KENTO%20Elec/view-part?ref=eda>
D2 D003 D4 D007 D008 D10 D11 = CrowPanel_Advance_HMI:DIODE*
D14 = CrowPanel_Advance_HMI:LED-SMT*
FB1 = LoraWAN_Gateway_Mainboard:L*
FB2 FB3 FB10 FB11 FB16-FB20 = CrowPanel_Advance_HMI:FB*
FPC2 = CrowPanel_Advance_HMI:FPC-6PIN-0.5MM
FPC3 = FPC:AFC24-S24FIA-00
IC1 = ESP32-C6-MINI-1-N4:ESP32-C6-MINI-1-N4: Multiprotocol Modules ESP32-C6 Module, supports Wi-Fi 6 in 2.4 GHz band, Bluetooth 5, Zigbee 3.0 and Thread - -40 to 105C Source: Datasheet <https://www.espressif.com/sites/default/files/documentation/esp32-c6-mini-1_mini-1u_datasheet_en.pdf>; DESCRIPTION: Multiprotocol Modules ESP32-C6 Module, supports Wi-Fi 6 in 2.4 GHz band, Bluetooth 5, Zigbee 3.0 and Thread - -40 to 105C; HEIGHT: mm; MANUFACTURER_NAME: Espressif Systems; MANUFACTURER_PART_NUMBER: ESP32-C6-MINI-1-N4; MOUSER_PART_NUMBER: 356-ESP32C6MINI-1-N4; MOUSER_PRICE-STOCK: https://www.mouser.co.uk/ProductDetail/Espressif-Systems/ESP32-C6-MINI-1-N4?qs=Jm2GQyTW%2FbjiJX9bVadqSw%3D%3D
IC2 IC3 IC7 IC8 = ME6211C18M(22M)5G-N:ME6211C18M5G-N: High Speed LDO Regulators, High PSRR, Low noise Source: Datasheet <https://datasheet.lcsc.com/lcsc/1809141122_MICRONE-Nanjing-Micro-One-Elec-ME6211C18M5G-N_C236671.pdf>; DESCRIPTION: High Speed LDO Regulators, High PSRR, Low noise; HEIGHT: 1.45mm; MANUFACTURER_NAME: Micron; MANUFACTURER_PART_NUMBER: ME6211C18M5G-N
IC4 = W25Q128JVSIQ:W25Q128JVSIQ: 128M-bit Serial Flash Memory with uniform 4KB sectors and Dual/Quad SPI Source: Datasheet <https://www.winbond.com/hq/search-resource-file.jsp?partNo=W25Q128JVSIQ&type=datasheet>; ARROW_PART_NUMBER: W25Q128JVSIQ; ARROW_PRICE-STOCK: https://www.arrow.com/en/products/w25q128jvsiq/winbond-electronics?utm_currency=USD&region=nac; DESCRIPTION: 128M-bit Serial Flash Memory with uniform 4KB sectors and Dual/Quad SPI; HEIGHT: 2.16mm; MANUFACTURER_NAME: Winbond; MANUFACTURER_PART_NUMBER: W25Q128JVSIQ; MOUSER_PART_NUMBER: 454-W25Q128JVSIQ; MOUSER_PRICE-STOCK: https://www.mouser.co.uk/ProductDetail/Winbond/W25Q128JVSIQ?qs=qSfuJ%252Bfl%2Fd6tLXvPR4fl9w%3D%3D
J1 J16 = CrowPanel_Advance_HMI:TYPEC-3.0-16P-SMD
J2 J13 = CrowPanel_Advance_HMI:CONNECTOR_TWIG-4P-2.0-SMD-FEMALE-REINFORCE
J3 J4 J6 = CrowPanel_Advance_HMI:PH2.0WT-2PIN
J5 = CrowPanel_Advance_HMI:HOLDER-MICROSD-9P
J7 = EAGLElib:CONN_8X2_SMD
J8 = Mini PC Case:HC-PZ200-8.7L-1X4PZ
J9 J11 = CrowPanel_Advance_HMI:HEADER-7P
J10 = CrowPanel_Advance_HMI:XH2.54-4P-SMT
J12 J14 J15 J17 = ESP32 Display 5.0 inch V1.2:CROWPANEL_ADVANCE_HMI_THO-M3.2*5MM-HOLE
JP1 = ESP32 Display 5.0 inch V1.2:CROWPANEL_ADVICE_HMI-4.3_COOPER_0.5MM-40PIN
K3 K4 = CrowPanel_Advance_HMI:KEY-6
L1 L5 L6 = SparkFun-Coils:4.7μH_SHIELDED_INDUCTOR: 4.7uH Inductor 4.7uH 1.4A 50mOhm 1008(2520) Package Shielded; PROD_ID: NDUC-14880
L4 = CrowPanel_Advance_HMI:L*
P1-P81 = CrowPanel_Advance_HMI:TEST_PAD*
Q1 Q2 Q4 Q6-Q9 = CrowPanel_Advance_HMI:MOSFET-N*: IRLL014: http://www.vishay.com/docs/91319/sihll014.pdf
Q3 Q5 = ESP32-P4 Display 7.0 inch V0.2(1):MY_LIB_RU30L30M
Q10 Q11 = CrowPanel_Advance_HMI:MOSFET-P: IRLL014: http://www.vishay.com/docs/91319/sihll014.pdf
R1-R11 R13-R15 R18 R21 R27-R30 R33 R48 R49 R54 R55 R60 R61 R66 R67 R69 R71-R73 R77 R79 R81-R86 R88-R91 R96 R101 R103 R106 R112-R119 R129 R139 R143 R149 R160 R164 R180 R181 R186 R187 R192 R210 = ESP32 Display 5.0 inch V1.2:CROWPANEL_ADVANCE_HMI_RES*
R12 R19 R20 R23 R25 R34-R44 R63-R65 R68 R70 R80 R95 R99 R100 R105 R107 R109-R111 R122 R133 R135 R152-R158 R176 R183 R188 R189 R191 = LoraWAN_Gateway_Mainboard:RES*
R16 R31 R32 R74 R159 = CrowPanel_Advance_HMI:RES*
R17 R22 R24 R26 R45-R47 R50-R52 R56-R59 R62 R75 R76 R78 R92-R94 R97 R98 R120 R121 R184 = RC:R0603
R53 = ESP32-P4 Display 7.0 inch V0.2:COOPER_R0603
R87 = ESP32-P4 Display 7.0 inch V0.2:CROWPANEL_ADVANCE_HMI_RES*
S1 = Mylib1:DSIC-01-TS-GER
SW1 = cooper:SWITCH_6PIN_2P
U1 = sale:CH340K
U2 = CrowPanel_Advance_HMI:TP4059-SOT23-6
U3 U13 = STC_MCUSTC8G1K08A:NS4168-ESOP-8
U5 = Mylib1:SGM3005XMSTR
U6 = CrowPanel_Advice_HMI 4.3:COOPER_MT9201
U7 = ESP32-P4NRW32:ESP32-P4NRW32: Check availability <https://pricing.snapeda.com/parts/ESP32-P4NRW32/Espressif%20Systems/view-part?ref=eda>; AVAILABILITY: Not in stock; CHECK_PRICES: https://www.snapeda.com/parts/ESP32-P4NRW32/Espressif+Systems/view-part/?ref=eda; DESCRIPTION: 高性能 MCU，带有一个 RISC-V 32 位双核微处理器; MF: Espressif Systems; MP: ESP32-P4NRW32; PACKAGE: None; PRICE: None; SNAPEDA_LINK: https://www.snapeda.com/parts/ESP32-P4NRW32/Espressif+Systems/view-part/?ref=snap
U8 = UMH3NTN:UMH3NTN: Dual NPN BJT with 4.7K Base resistor Datasheet <https://fscdn.rohm.com/en/products/databook/datasheet/discrete/transistor/digital/umh3ntn-e.pdf> BUY NOW <https://www.digikey.ca/en/products/detail/rohm-semiconductor/umh3ntn/659279> Check availability <https://pricing.snapeda.com/parts/UMH3NTN/Rohm/view-part?ref=eda>; AVAILABILITY: In Stock; CHECK_PRICES: https://www.snapeda.com/parts/UMH3NTN/Rohm/view-part/?ref=eda; DESCRIPTION: Pre-Biased Bipolar Transistor (BJT) 2 NPN - Pre-Biased (Dual) 50V 100mA 250MHz 150mW Surface Mount UMT6; MF: Rohm; MP: UMH3NTN; PACKAGE: SOT-363 Rohm; PRICE: None; PURCHASE-URL: https://www.snapeda.com/api/url_track_click_mouser/?unipart_id=355768&manufacturer=Rohm&part_name=UMH3NTN&search_term=umh3n; SNAPEDA_LINK: https://www.snapeda.com/parts/UMH3NTN/Rohm/view-part/?ref=snap
U9 U10 = TLV62569DBVR:TLV62569DBVR: Check availability <https://pricing.snapeda.com/parts/TLV62569DBVR/Texas%20Instruments/view-part?ref=eda>; AVAILABILITY: In Stock; CHECK_PRICES: https://www.snapeda.com/parts/TLV62569DBVR/Texas+Instruments/view-part/?ref=eda; DESCRIPTION: 2.5V-5.5V input, 2-A high efficiency step-down buck converter in SOT23 and SOT563 package; MF: Texas Instruments; MP: TLV62569DBVR; PACKAGE: SOT-23-5 Texas Instruments; PRICE: None; SNAPEDA_LINK: https://www.snapeda.com/parts/TLV62569DBVR/Texas+Instruments/view-part/?ref=snap
U14 = MY_LIB:STC8H1K08-36I
U175 = ESP32 Display 5.0 inch V1.2:MMICT5838-00-012_LMD3526B261-OFA03
Y2 = X322540MPB4SI_40MHZ:X322540MPB4SI: SMD Crystal Resonators 40MHz +/-10ppm SMD-3225_4P RoHS Source: Datasheet <https://datasheet.lcsc.com/szlcsc/Yangxing-Tech-X322540MPB4SI_C9010.pdf>; DESCRIPTION: SMD Crystal Resonators 40MHz +/-10ppm SMD-3225_4P RoHS; HEIGHT: 0.8mm; MANUFACTURER_NAME: Yangxing Tech; MANUFACTURER_PART_NUMBER: X322540MPB4SI
Y3 = 24MHZ_1631-24003-BTKEYA:24MHZ
Y4 = nRF52832_MCU:NORDIC_NRF_XTAL_32KHZ